# EAGLE design hashing.board (EAGLE 6.5.0)

## Sheet 1 of 4
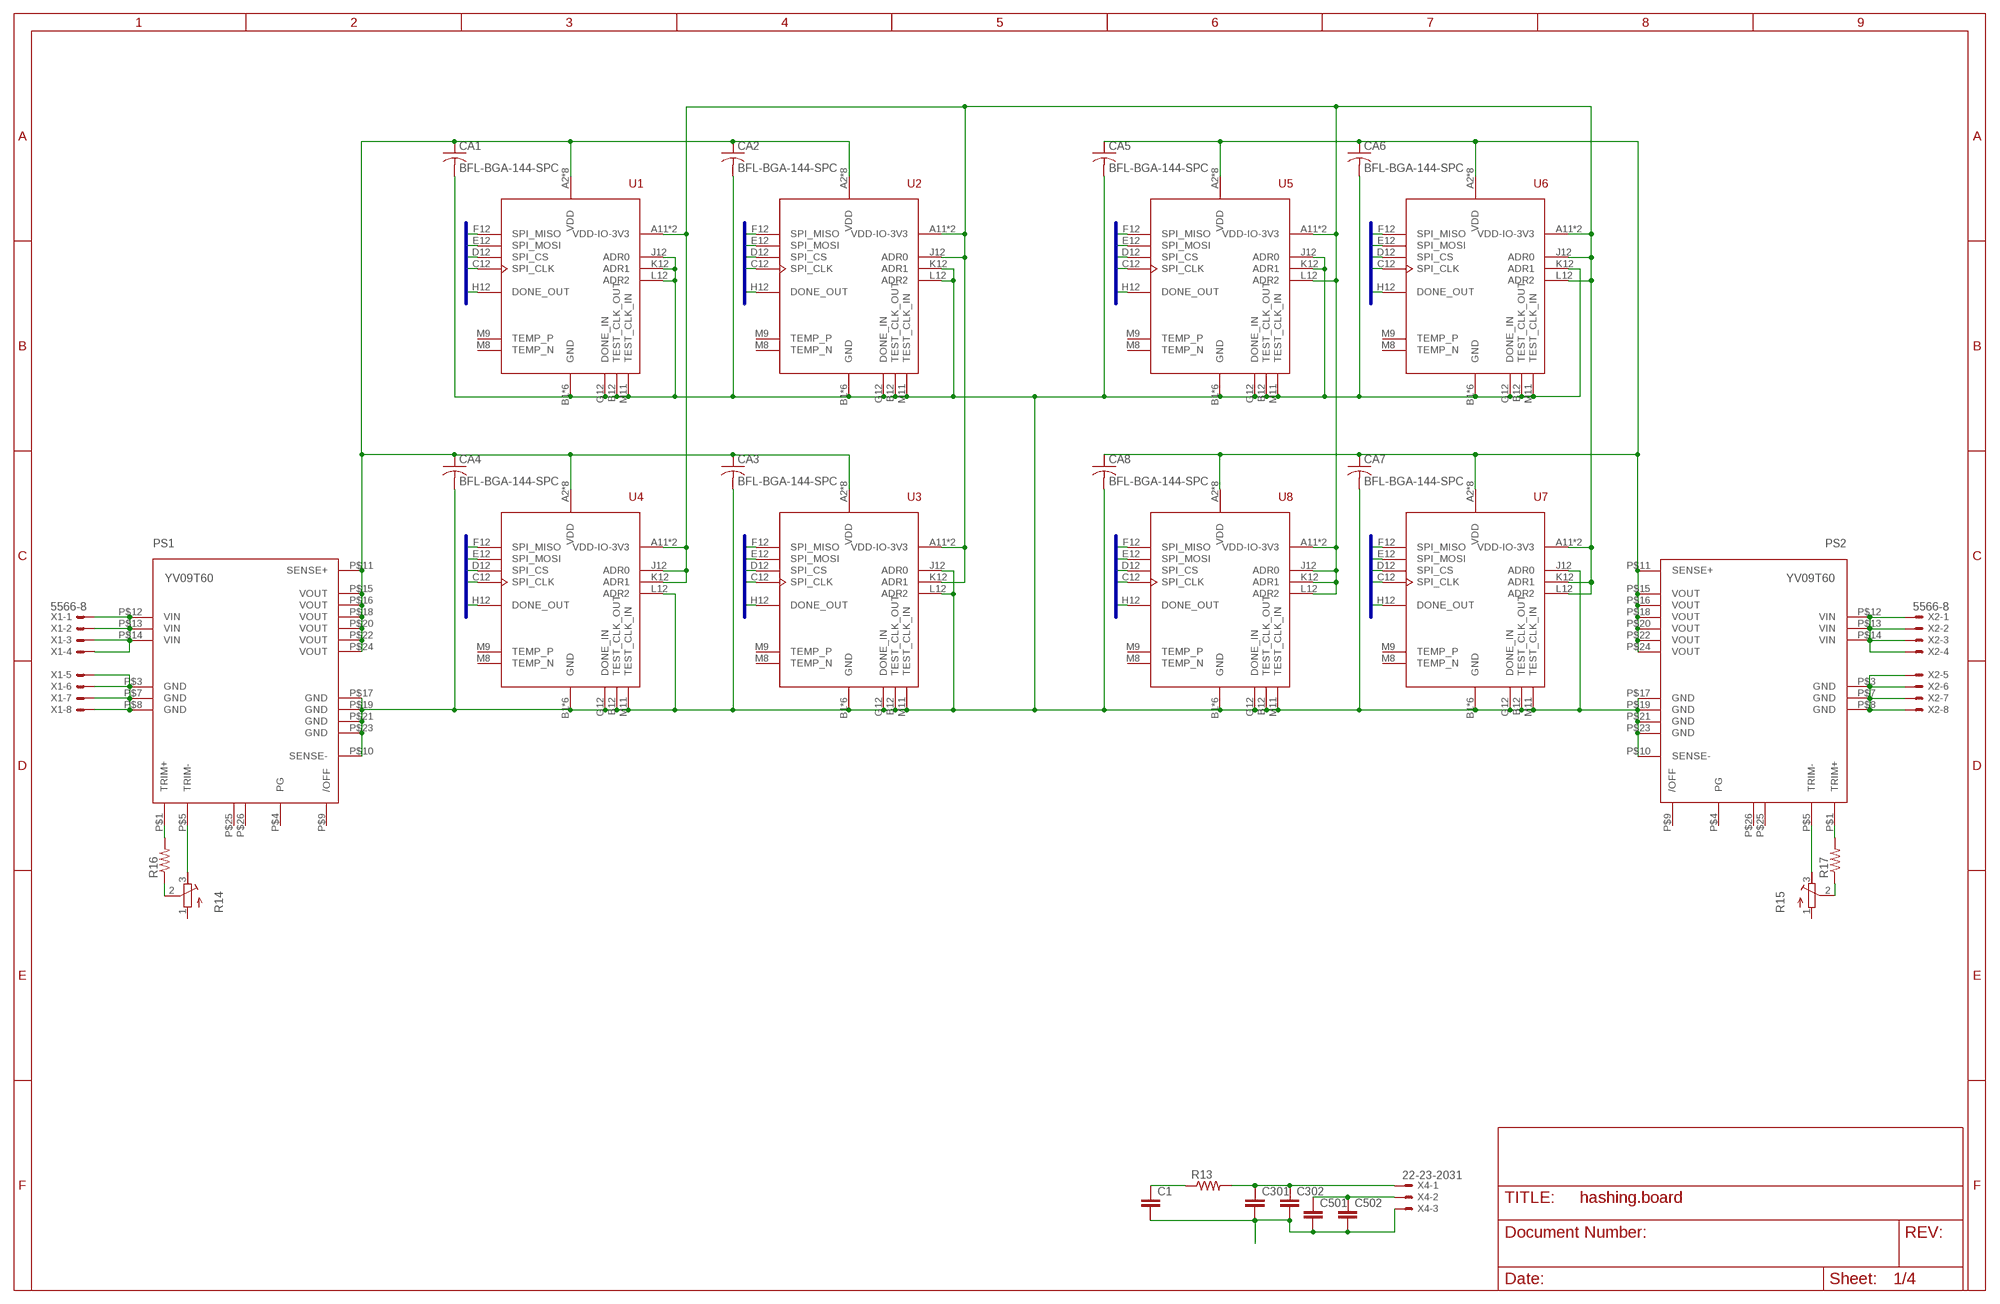
[diagram p0: schematic, sheet 1]

### Parts
C1  C-EUC0805K  [C0805K]
C301  C-EUC0805K  [C0805K]
C302  C-EUC1210K  [C1210K]
C501  C-EUC0805K  [C0805K]
C502  C-EUC1210K  [C1210K]
CA1  BFL-BGA-144-SPC  [BFL-BGA-VIA-PATTERN]
CA2  BFL-BGA-144-SPC  [BFL-BGA-VIA-PATTERN]
CA3  BFL-BGA-144-SPC  [BFL-BGA-VIA-PATTERN]
CA4  BFL-BGA-144-SPC  [BFL-BGA-VIA-PATTERN]
CA5  BFL-BGA-144-SPC  [BFL-BGA-VIA-PATTERN]
CA6  BFL-BGA-144-SPC  [BFL-BGA-VIA-PATTERN]
CA7  BFL-BGA-144-SPC  [BFL-BGA-VIA-PATTERN]
CA8  BFL-BGA-144-SPC  [BFL-BGA-VIA-PATTERN]
PS1  YV09T60  [YV09T60]
PS2  YV09T60  [YV09T60]
R13  R-US_R0805W  [R0805W]
R14  R-TRIMM3224J  [RTRIM3224J]
R15  R-TRIMM3224J  [RTRIM3224J]
R16  R-US_R0805W  [R0805W]
R17  R-US_R0805W  [R0805W]
U1  BFL-ASIC-1  [BFL-BGA-BIG-PADS]
U2  BFL-ASIC-1  [BFL-BGA-BIG-PADS]
U3  BFL-ASIC-1  [BFL-BGA-BIG-PADS]
U4  BFL-ASIC-1  [BFL-BGA-BIG-PADS]
U5  BFL-ASIC-1  [BFL-BGA-BIG-PADS]
U6  BFL-ASIC-1  [BFL-BGA-BIG-PADS]
U7  BFL-ASIC-1  [BFL-BGA-BIG-PADS]
U8  BFL-ASIC-1  [BFL-BGA-BIG-PADS]
X1  5566-8  [5566-8]
X2  5566-8  [5566-8]
X4  22-23-2031  [22-23-2031]

### Nets
DONE0: U1.H12(DONE_OUT) ; also sheet 2
DONE1: U2.H12(DONE_OUT) ; also sheet 2
DONE2: U3.H12(DONE_OUT) ; also sheet 2
DONE3: U4.H12(DONE_OUT) ; also sheet 2
DONE4: U5.H12(DONE_OUT) ; also sheet 2
DONE5: U6.H12(DONE_OUT) ; also sheet 2
DONE6: U8.H12(DONE_OUT) ; also sheet 2
DONE7: U7.H12(DONE_OUT) ; also sheet 2
GND: C1.2 C301.2 C302.2 C501.2 C502.2 CA1.N$2 CA1.N$3 CA1.N$5 CA1.N$6 CA1.N$8 CA1.N$9 CA1.N$11 CA1.N$12 CA1.N$14 CA1.N$15 CA1.N$16 CA1.N$17 CA1.N$19 CA1.N$21 CA1.N$23 CA1.N$25 CA1.N$27 CA1.N$28 CA1.N$30 CA1.N$31 CA1.N$33 CA1.N$34 CA1.N$36 CA1.N$37 CA1.N$39 CA1.N$40 CA1.N$42 CA1.N$43 CA1.N$44 CA1.N$45 CA1.N$55 CA1.N$62 CA1.N$64 CA1.N$66 CA1.N$68 CA1.N$70 CA1.N$72 CA1.N$74 CA1.N$76 CA1.N$78 CA1.N$80 CA1.N$82 CA1.N$84 CA1.N$86 CA1.N$88 CA1.N$90 CA1.N$92 CA1.N$94 CA1.N$98 CA1.N$100 CA1.N$102 CA1.N$104 CA1.N$106 CA1.N$110 CA2.N$2 CA2.N$3 CA2.N$5 CA2.N$6 CA2.N$8 CA2.N$9 CA2.N$11 CA2.N$12 CA2.N$14 CA2.N$15 CA2.N$16 CA2.N$17 CA2.N$19 CA2.N$21 CA2.N$23 CA2.N$25 CA2.N$27 CA2.N$28 CA2.N$30 CA2.N$31 CA2.N$33 CA2.N$34 CA2.N$36 CA2.N$37 CA2.N$39 CA2.N$40 CA2.N$42 CA2.N$43 CA2.N$44 CA2.N$45 CA2.N$55 CA2.N$62 CA2.N$64 CA2.N$66 CA2.N$68 CA2.N$70 CA2.N$72 CA2.N$74 CA2.N$76 CA2.N$78 CA2.N$80 CA2.N$82 CA2.N$84 CA2.N$86 CA2.N$88 CA2.N$90 CA2.N$92 CA2.N$94 CA2.N$98 CA2.N$100 CA2.N$102 CA2.N$104 CA2.N$106 CA2.N$110 CA3.N$2 CA3.N$3 CA3.N$5 CA3.N$6 CA3.N$8 CA3.N$9 CA3.N$11 CA3.N$12 CA3.N$14 CA3.N$15 CA3.N$16 CA3.N$17 CA3.N$19 CA3.N$21 CA3.N$23 CA3.N$25 CA3.N$27 CA3.N$28 CA3.N$30 CA3.N$31 CA3.N$33 CA3.N$34 CA3.N$36 CA3.N$37 CA3.N$39 CA3.N$40 CA3.N$42 CA3.N$43 CA3.N$44 CA3.N$45 CA3.N$55 CA3.N$62 CA3.N$64 CA3.N$66 CA3.N$68 CA3.N$70 CA3.N$72 CA3.N$74 CA3.N$76 CA3.N$78 CA3.N$80 CA3.N$82 CA3.N$84 CA3.N$86 CA3.N$88 CA3.N$90 CA3.N$92 CA3.N$94 CA3.N$98 CA3.N$100 CA3.N$102 CA3.N$104 CA3.N$106 CA3.N$110 CA4.N$2 CA4.N$3 CA4.N$5 CA4.N$6 CA4.N$8 CA4.N$9 CA4.N$11 CA4.N$12 CA4.N$14 CA4.N$15 CA4.N$16 CA4.N$17 CA4.N$19 CA4.N$21 CA4.N$23 CA4.N$25 CA4.N$27 CA4.N$28 CA4.N$30 CA4.N$31 CA4.N$33 CA4.N$34 CA4.N$36 CA4.N$37 CA4.N$39 CA4.N$40 CA4.N$42 CA4.N$43 CA4.N$44 CA4.N$45 CA4.N$55 CA4.N$62 CA4.N$64 CA4.N$66 CA4.N$68 CA4.N$70 CA4.N$72 CA4.N$74 CA4.N$76 CA4.N$78 CA4.N$80 CA4.N$82 CA4.N$84 CA4.N$86 CA4.N$88 CA4.N$90 CA4.N$92 CA4.N$94 CA4.N$98 CA4.N$100 CA4.N$102 CA4.N$104 CA4.N$106 CA4.N$110 CA5.N$2 CA5.N$3 CA5.N$5 CA5.N$6 CA5.N$8 CA5.N$9 CA5.N$11 CA5.N$12 CA5.N$14 CA5.N$15 CA5.N$16 CA5.N$17 CA5.N$19 CA5.N$21 CA5.N$23 CA5.N$25 CA5.N$27 CA5.N$28 CA5.N$30 CA5.N$31 CA5.N$33 CA5.N$34 CA5.N$36 CA5.N$37 CA5.N$39 CA5.N$40 CA5.N$42 CA5.N$43 CA5.N$44 CA5.N$45 CA5.N$55 CA5.N$62 CA5.N$64 CA5.N$66 CA5.N$68 CA5.N$70 CA5.N$72 CA5.N$74 CA5.N$76 CA5.N$78 CA5.N$80 CA5.N$82 CA5.N$84 CA5.N$86 CA5.N$88 CA5.N$90 CA5.N$92 CA5.N$94 CA5.N$98 CA5.N$100 CA5.N$102 CA5.N$104 CA5.N$106 CA5.N$110 CA6.N$2 CA6.N$3 CA6.N$5 CA6.N$6 CA6.N$8 CA6.N$9 CA6.N$11 CA6.N$12 CA6.N$14 CA6.N$15 CA6.N$16 CA6.N$17 CA6.N$19 CA6.N$21 CA6.N$23 CA6.N$25 CA6.N$27 CA6.N$28 CA6.N$30 CA6.N$31 CA6.N$33 CA6.N$34 CA6.N$36 CA6.N$37 CA6.N$39 CA6.N$40 CA6.N$42 CA6.N$43 CA6.N$44 CA6.N$45 CA6.N$55 CA6.N$62 CA6.N$64 CA6.N$66 CA6.N$68 CA6.N$70 CA6.N$72 CA6.N$74 CA6.N$76 CA6.N$78 CA6.N$80 CA6.N$82 CA6.N$84 CA6.N$86 CA6.N$88 CA6.N$90 CA6.N$92 CA6.N$94 CA6.N$98 CA6.N$100 CA6.N$102 CA6.N$104 CA6.N$106 CA6.N$110 CA7.N$2 CA7.N$3 CA7.N$5 CA7.N$6 CA7.N$8 CA7.N$9 CA7.N$11 CA7.N$12 CA7.N$14 CA7.N$15 CA7.N$16 CA7.N$17 CA7.N$19 CA7.N$21 CA7.N$23 CA7.N$25 CA7.N$27 CA7.N$28 CA7.N$30 CA7.N$31 CA7.N$33 CA7.N$34 CA7.N$36 CA7.N$37 CA7.N$39 CA7.N$40 CA7.N$42 CA7.N$43 CA7.N$44 CA7.N$45 CA7.N$55 CA7.N$62 CA7.N$64 CA7.N$66 CA7.N$68 CA7.N$70 CA7.N$72 CA7.N$74 CA7.N$76 CA7.N$78 CA7.N$80 CA7.N$82 CA7.N$84 CA7.N$86 CA7.N$88 CA7.N$90 CA7.N$92 CA7.N$94 CA7.N$98 CA7.N$100 CA7.N$102 CA7.N$104 CA7.N$106 CA7.N$110 CA8.N$2 CA8.N$3 CA8.N$5 CA8.N$6 CA8.N$8 CA8.N$9 CA8.N$11 CA8.N$12 CA8.N$14 CA8.N$15 CA8.N$16 CA8.N$17 CA8.N$19 CA8.N$21 CA8.N$23 CA8.N$25 CA8.N$27 CA8.N$28 CA8.N$30 CA8.N$31 CA8.N$33 CA8.N$34 CA8.N$36 CA8.N$37 CA8.N$39 CA8.N$40 CA8.N$42 CA8.N$43 CA8.N$44 CA8.N$45 CA8.N$55 CA8.N$62 CA8.N$64 CA8.N$66 CA8.N$68 CA8.N$70 CA8.N$72 CA8.N$74 CA8.N$76 CA8.N$78 CA8.N$80 CA8.N$82 CA8.N$84 CA8.N$86 CA8.N$88 CA8.N$90 CA8.N$92 CA8.N$94 CA8.N$98 CA8.N$100 CA8.N$102 CA8.N$104 CA8.N$106 CA8.N$110 PS1.P$3(GND) PS1.P$7(GND) PS1.P$8(GND) PS1.P$10(SENSE-) PS1.P$17(GND) PS1.P$19(GND) PS1.P$21(GND) PS1.P$23(GND) PS2.P$3(GND) PS2.P$7(GND) PS2.P$8(GND) PS2.P$10(SENSE-) PS2.P$17(GND) PS2.P$19(GND) PS2.P$21(GND) PS2.P$23(GND) U1.B1(GND) U1.B3(GND) U1.B5(GND) U1.B7(GND) U1.B9(GND) U1.B11(GND) U1.B12(TEST_CLK_OUT) U1.G12(DONE_IN) U1.J12(ADR0) U1.K12(ADR1) U1.L12(ADR2) U1.M11(TEST_CLK_IN) U2.B1(GND) U2.B3(GND) U2.B5(GND) U2.B7(GND) U2.B9(GND) U2.B11(GND) U2.B12(TEST_CLK_OUT) U2.G12(DONE_IN) U2.K12(ADR1) U2.L12(ADR2) U2.M11(TEST_CLK_IN) U3.B1(GND) U3.B3(GND) U3.B5(GND) U3.B7(GND) U3.B9(GND) U3.B11(GND) U3.B12(TEST_CLK_OUT) U3.G12(DONE_IN) U3.J12(ADR0) U3.L12(ADR2) U3.M11(TEST_CLK_IN) U4.B1(GND) U4.B3(GND) U4.B5(GND) U4.B7(GND) U4.B9(GND) U4.B11(GND) U4.B12(TEST_CLK_OUT) U4.G12(DONE_IN) U4.L12(ADR2) U4.M11(TEST_CLK_IN) U5.B1(GND) U5.B3(GND) U5.B5(GND) U5.B7(GND) U5.B9(GND) U5.B11(GND) U5.B12(TEST_CLK_OUT) U5.G12(DONE_IN) U5.J12(ADR0) U5.K12(ADR1) U5.M11(TEST_CLK_IN) U6.B1(GND) U6.B3(GND) U6.B5(GND) U6.B7(GND) U6.B9(GND) U6.B11(GND) U6.B12(TEST_CLK_OUT) U6.G12(DONE_IN) U6.K12(ADR1) U6.M11(TEST_CLK_IN) U7.B1(GND) U7.B3(GND) U7.B5(GND) U7.B7(GND) U7.B9(GND) U7.B11(GND) U7.B12(TEST_CLK_OUT) U7.G12(DONE_IN) U7.J12(ADR0) U7.M11(TEST_CLK_IN) U8.B1(GND) U8.B3(GND) U8.B5(GND) U8.B7(GND) U8.B9(GND) U8.B11(GND) U8.B12(TEST_CLK_OUT) U8.G12(DONE_IN) U8.M11(TEST_CLK_IN) X1.5 X1.6 X1.7 X1.8 X2.5 X2.6 X2.7 X2.8 X4.3 ; also sheet 2
N$5: R15.2(S) R17.1
N$6: PS2.P$1(TRIM+) R17.2
N$7: PS2.P$5(TRIM-) R15.3(A)
N$8: PS1.P$5(TRIM-) R14.3(A)
N$9: R14.2(S) R16.1
N$10: PS1.P$1(TRIM+) R16.2
SPI_1_CLK: U1.C12(SPI_CLK) U2.C12(SPI_CLK) U3.C12(SPI_CLK) U4.C12(SPI_CLK) U5.C12(SPI_CLK) U6.C12(SPI_CLK) U7.C12(SPI_CLK) U8.C12(SPI_CLK) ; also sheet 2
SPI_1_CS: U1.D12(SPI_CS) U2.D12(SPI_CS) U3.D12(SPI_CS) U4.D12(SPI_CS) U5.D12(SPI_CS) U6.D12(SPI_CS) U7.D12(SPI_CS) U8.D12(SPI_CS) ; also sheet 2
SPI_1_MISO: U1.F12(SPI_MISO) U2.F12(SPI_MISO) U3.F12(SPI_MISO) U4.F12(SPI_MISO) U5.F12(SPI_MISO) U6.F12(SPI_MISO) U7.F12(SPI_MISO) U8.F12(SPI_MISO) ; also sheet 2
SPI_1_MOSI: U1.E12(SPI_MOSI) U2.E12(SPI_MOSI) U3.E12(SPI_MOSI) U4.E12(SPI_MOSI) U5.E12(SPI_MOSI) U6.E12(SPI_MOSI) U7.E12(SPI_MOSI) U8.E12(SPI_MOSI) ; also sheet 2
VDD-1A: CA1.P$1 CA1.P$4 CA1.P$7 CA1.P$10 CA1.P$13 CA1.P$18 CA1.P$20 CA1.P$22 CA1.P$24 CA1.P$26 CA1.P$29 CA1.P$32 CA1.P$35 CA1.P$38 CA1.P$41 CA1.P$46 CA1.P$47 CA1.P$48 CA1.P$50 CA1.P$51 CA1.P$52 CA1.P$53 CA1.P$54 CA1.P$56 CA1.P$57 CA1.P$58 CA1.P$59 CA1.P$60 CA1.P$61 CA1.P$63 CA1.P$65 CA1.P$67 CA1.P$69 CA1.P$71 CA1.P$73 CA1.P$75 CA1.P$77 CA1.P$79 CA1.P$81 CA1.P$83 CA1.P$85 CA1.P$87 CA1.P$89 CA1.P$91 CA1.P$93 CA1.P$95 CA1.P$99 CA1.P$101 CA1.P$103 CA1.P$105 CA1.P$107 CA1.P$111 CA2.P$1 CA2.P$4 CA2.P$7 CA2.P$10 CA2.P$13 CA2.P$18 CA2.P$20 CA2.P$22 CA2.P$24 CA2.P$26 CA2.P$29 CA2.P$32 CA2.P$35 CA2.P$38 CA2.P$41 CA2.P$46 CA2.P$47 CA2.P$48 CA2.P$50 CA2.P$51 CA2.P$52 CA2.P$53 CA2.P$54 CA2.P$56 CA2.P$57 CA2.P$58 CA2.P$59 CA2.P$60 CA2.P$61 CA2.P$63 CA2.P$65 CA2.P$67 CA2.P$69 CA2.P$71 CA2.P$73 CA2.P$75 CA2.P$77 CA2.P$79 CA2.P$81 CA2.P$83 CA2.P$85 CA2.P$87 CA2.P$89 CA2.P$91 CA2.P$93 CA2.P$95 CA2.P$99 CA2.P$101 CA2.P$103 CA2.P$105 CA2.P$107 CA2.P$111 CA3.P$1 CA3.P$4 CA3.P$7 CA3.P$10 CA3.P$13 CA3.P$18 CA3.P$20 CA3.P$22 CA3.P$24 CA3.P$26 CA3.P$29 CA3.P$32 CA3.P$35 CA3.P$38 CA3.P$41 CA3.P$46 CA3.P$47 CA3.P$48 CA3.P$50 CA3.P$51 CA3.P$52 CA3.P$53 CA3.P$54 CA3.P$56 CA3.P$57 CA3.P$58 CA3.P$59 CA3.P$60 CA3.P$61 CA3.P$63 CA3.P$65 CA3.P$67 CA3.P$69 CA3.P$71 CA3.P$73 CA3.P$75 CA3.P$77 CA3.P$79 CA3.P$81 CA3.P$83 CA3.P$85 CA3.P$87 CA3.P$89 CA3.P$91 CA3.P$93 CA3.P$95 CA3.P$99 CA3.P$101 CA3.P$103 CA3.P$105 CA3.P$107 CA3.P$111 CA4.P$1 CA4.P$4 CA4.P$7 CA4.P$10 CA4.P$13 CA4.P$18 CA4.P$20 CA4.P$22 CA4.P$24 CA4.P$26 CA4.P$29 CA4.P$32 CA4.P$35 CA4.P$38 CA4.P$41 CA4.P$46 CA4.P$47 CA4.P$48 CA4.P$50 CA4.P$51 CA4.P$52 CA4.P$53 CA4.P$54 CA4.P$56 CA4.P$57 CA4.P$58 CA4.P$59 CA4.P$60 CA4.P$61 CA4.P$63 CA4.P$65 CA4.P$67 CA4.P$69 CA4.P$71 CA4.P$73 CA4.P$75 CA4.P$77 CA4.P$79 CA4.P$81 CA4.P$83 CA4.P$85 CA4.P$87 CA4.P$89 CA4.P$91 CA4.P$93 CA4.P$95 CA4.P$99 CA4.P$101 CA4.P$103 CA4.P$105 CA4.P$107 CA4.P$111 PS1.P$11(SENSE+) PS1.P$15(VOUT) PS1.P$16(VOUT) PS1.P$18(VOUT) PS1.P$20(VOUT) PS1.P$22(VOUT) PS1.P$24(VOUT) U1.A2(VDD) U1.A4(VDD) U1.A6(VDD) U1.A8(VDD) U1.A9(VDD) U1.A10(VDD) U1.M5(VDD) U1.M7(VDD) U2.A2(VDD) U2.A4(VDD) U2.A6(VDD) U2.A8(VDD) U2.A9(VDD) U2.A10(VDD) U2.M5(VDD) U2.M7(VDD) U3.A2(VDD) U3.A4(VDD) U3.A6(VDD) U3.A8(VDD) U3.A9(VDD) U3.A10(VDD) U3.M5(VDD) U3.M7(VDD) U4.A2(VDD) U4.A4(VDD) U4.A6(VDD) U4.A8(VDD) U4.A9(VDD) U4.A10(VDD) U4.M5(VDD) U4.M7(VDD)
VDD-1B: CA5.P$1 CA5.P$4 CA5.P$7 CA5.P$10 CA5.P$13 CA5.P$18 CA5.P$20 CA5.P$22 CA5.P$24 CA5.P$26 CA5.P$29 CA5.P$32 CA5.P$35 CA5.P$38 CA5.P$41 CA5.P$46 CA5.P$47 CA5.P$48 CA5.P$50 CA5.P$51 CA5.P$52 CA5.P$53 CA5.P$54 CA5.P$56 CA5.P$57 CA5.P$58 CA5.P$59 CA5.P$60 CA5.P$61 CA5.P$63 CA5.P$65 CA5.P$67 CA5.P$69 CA5.P$71 CA5.P$73 CA5.P$75 CA5.P$77 CA5.P$79 CA5.P$81 CA5.P$83 CA5.P$85 CA5.P$87 CA5.P$89 CA5.P$91 CA5.P$93 CA5.P$95 CA5.P$99 CA5.P$101 CA5.P$103 CA5.P$105 CA5.P$107 CA5.P$111 CA6.P$1 CA6.P$4 CA6.P$7 CA6.P$10 CA6.P$13 CA6.P$18 CA6.P$20 CA6.P$22 CA6.P$24 CA6.P$26 CA6.P$29 CA6.P$32 CA6.P$35 CA6.P$38 CA6.P$41 CA6.P$46 CA6.P$47 CA6.P$48 CA6.P$50 CA6.P$51 CA6.P$52 CA6.P$53 CA6.P$54 CA6.P$56 CA6.P$57 CA6.P$58 CA6.P$59 CA6.P$60 CA6.P$61 CA6.P$63 CA6.P$65 CA6.P$67 CA6.P$69 CA6.P$71 CA6.P$73 CA6.P$75 CA6.P$77 CA6.P$79 CA6.P$81 CA6.P$83 CA6.P$85 CA6.P$87 CA6.P$89 CA6.P$91 CA6.P$93 CA6.P$95 CA6.P$99 CA6.P$101 CA6.P$103 CA6.P$105 CA6.P$107 CA6.P$111 CA7.P$1 CA7.P$4 CA7.P$7 CA7.P$10 CA7.P$13 CA7.P$18 CA7.P$20 CA7.P$22 CA7.P$24 CA7.P$26 CA7.P$29 CA7.P$32 CA7.P$35 CA7.P$38 CA7.P$41 CA7.P$46 CA7.P$47 CA7.P$48 CA7.P$50 CA7.P$51 CA7.P$52 CA7.P$53 CA7.P$54 CA7.P$56 CA7.P$57 CA7.P$58 CA7.P$59 CA7.P$60 CA7.P$61 CA7.P$63 CA7.P$65 CA7.P$67 CA7.P$69 CA7.P$71 CA7.P$73 CA7.P$75 CA7.P$77 CA7.P$79 CA7.P$81 CA7.P$83 CA7.P$85 CA7.P$87 CA7.P$89 CA7.P$91 CA7.P$93 CA7.P$95 CA7.P$99 CA7.P$101 CA7.P$103 CA7.P$105 CA7.P$107 CA7.P$111 CA8.P$1 CA8.P$4 CA8.P$7 CA8.P$10 CA8.P$13 CA8.P$18 CA8.P$20 CA8.P$22 CA8.P$24 CA8.P$26 CA8.P$29 CA8.P$32 CA8.P$35 CA8.P$38 CA8.P$41 CA8.P$46 CA8.P$47 CA8.P$48 CA8.P$50 CA8.P$51 CA8.P$52 CA8.P$53 CA8.P$54 CA8.P$56 CA8.P$57 CA8.P$58 CA8.P$59 CA8.P$60 CA8.P$61 CA8.P$63 CA8.P$65 CA8.P$67 CA8.P$69 CA8.P$71 CA8.P$73 CA8.P$75 CA8.P$77 CA8.P$79 CA8.P$81 CA8.P$83 CA8.P$85 CA8.P$87 CA8.P$89 CA8.P$91 CA8.P$93 CA8.P$95 CA8.P$99 CA8.P$101 CA8.P$103 CA8.P$105 CA8.P$107 CA8.P$111 PS2.P$11(SENSE+) PS2.P$15(VOUT) PS2.P$16(VOUT) PS2.P$18(VOUT) PS2.P$20(VOUT) PS2.P$22(VOUT) PS2.P$24(VOUT) U5.A2(VDD) U5.A4(VDD) U5.A6(VDD) U5.A8(VDD) U5.A9(VDD) U5.A10(VDD) U5.M5(VDD) U5.M7(VDD) U6.A2(VDD) U6.A4(VDD) U6.A6(VDD) U6.A8(VDD) U6.A9(VDD) U6.A10(VDD) U6.M5(VDD) U6.M7(VDD) U7.A2(VDD) U7.A4(VDD) U7.A6(VDD) U7.A8(VDD) U7.A9(VDD) U7.A10(VDD) U7.M5(VDD) U7.M7(VDD) U8.A2(VDD) U8.A4(VDD) U8.A6(VDD) U8.A8(VDD) U8.A9(VDD) U8.A10(VDD) U8.M5(VDD) U8.M7(VDD)
VDD-3V3: C1.1 R13.1 U1.A11(VDD-IO-3V3) U1.M10(VDD-IO-3V3) U2.A11(VDD-IO-3V3) U2.J12(ADR0) U2.M10(VDD-IO-3V3) U3.A11(VDD-IO-3V3) U3.K12(ADR1) U3.M10(VDD-IO-3V3) U4.A11(VDD-IO-3V3) U4.J12(ADR0) U4.K12(ADR1) U4.M10(VDD-IO-3V3) U5.A11(VDD-IO-3V3) U5.L12(ADR2) U5.M10(VDD-IO-3V3) U6.A11(VDD-IO-3V3) U6.J12(ADR0) U6.L12(ADR2) U6.M10(VDD-IO-3V3) U7.A11(VDD-IO-3V3) U7.K12(ADR1) U7.L12(ADR2) U7.M10(VDD-IO-3V3) U8.A11(VDD-IO-3V3) U8.J12(ADR0) U8.K12(ADR1) U8.L12(ADR2) U8.M10(VDD-IO-3V3)
VIN1: PS1.P$12(VIN) PS1.P$13(VIN) PS1.P$14(VIN) X1.1 X1.2 X1.3 X1.4
VIN2: PS2.P$12(VIN) PS2.P$13(VIN) PS2.P$14(VIN) X2.1 X2.2 X2.3 X2.4
VIN-3.3V: C301.1 C302.1 R13.2 X4.1
VIN-5.0V: C501.1 C502.1 X4.2
Unconnected: PS1.P$2 PS1.P$4(PG) PS1.P$6(DNC) PS1.P$9(/OFF) PS1.P$25(MECH1) PS1.P$26(MECH2) PS2.P$2 PS2.P$4(PG) PS2.P$6(DNC) PS2.P$9(/OFF) PS2.P$25(MECH1) PS2.P$26(MECH2) R14.1(E) R15.1(E) U1.M8(TEMP_N) U1.M9(TEMP_P) U2.M8(TEMP_N) U2.M9(TEMP_P) U3.M8(TEMP_N) U3.M9(TEMP_P) U4.M8(TEMP_N) U4.M9(TEMP_P) U5.M8(TEMP_N) U5.M9(TEMP_P) U6.M8(TEMP_N) U6.M9(TEMP_P) U7.M8(TEMP_N) U7.M9(TEMP_P) U8.M8(TEMP_N) U8.M9(TEMP_P)

### Buses
ASIC_COM:SPI_1_MISO,SPI_1_MOSI,SPI_1_CLK,SPI_1_CS,DONE[0..7]

## Sheet 2 of 4
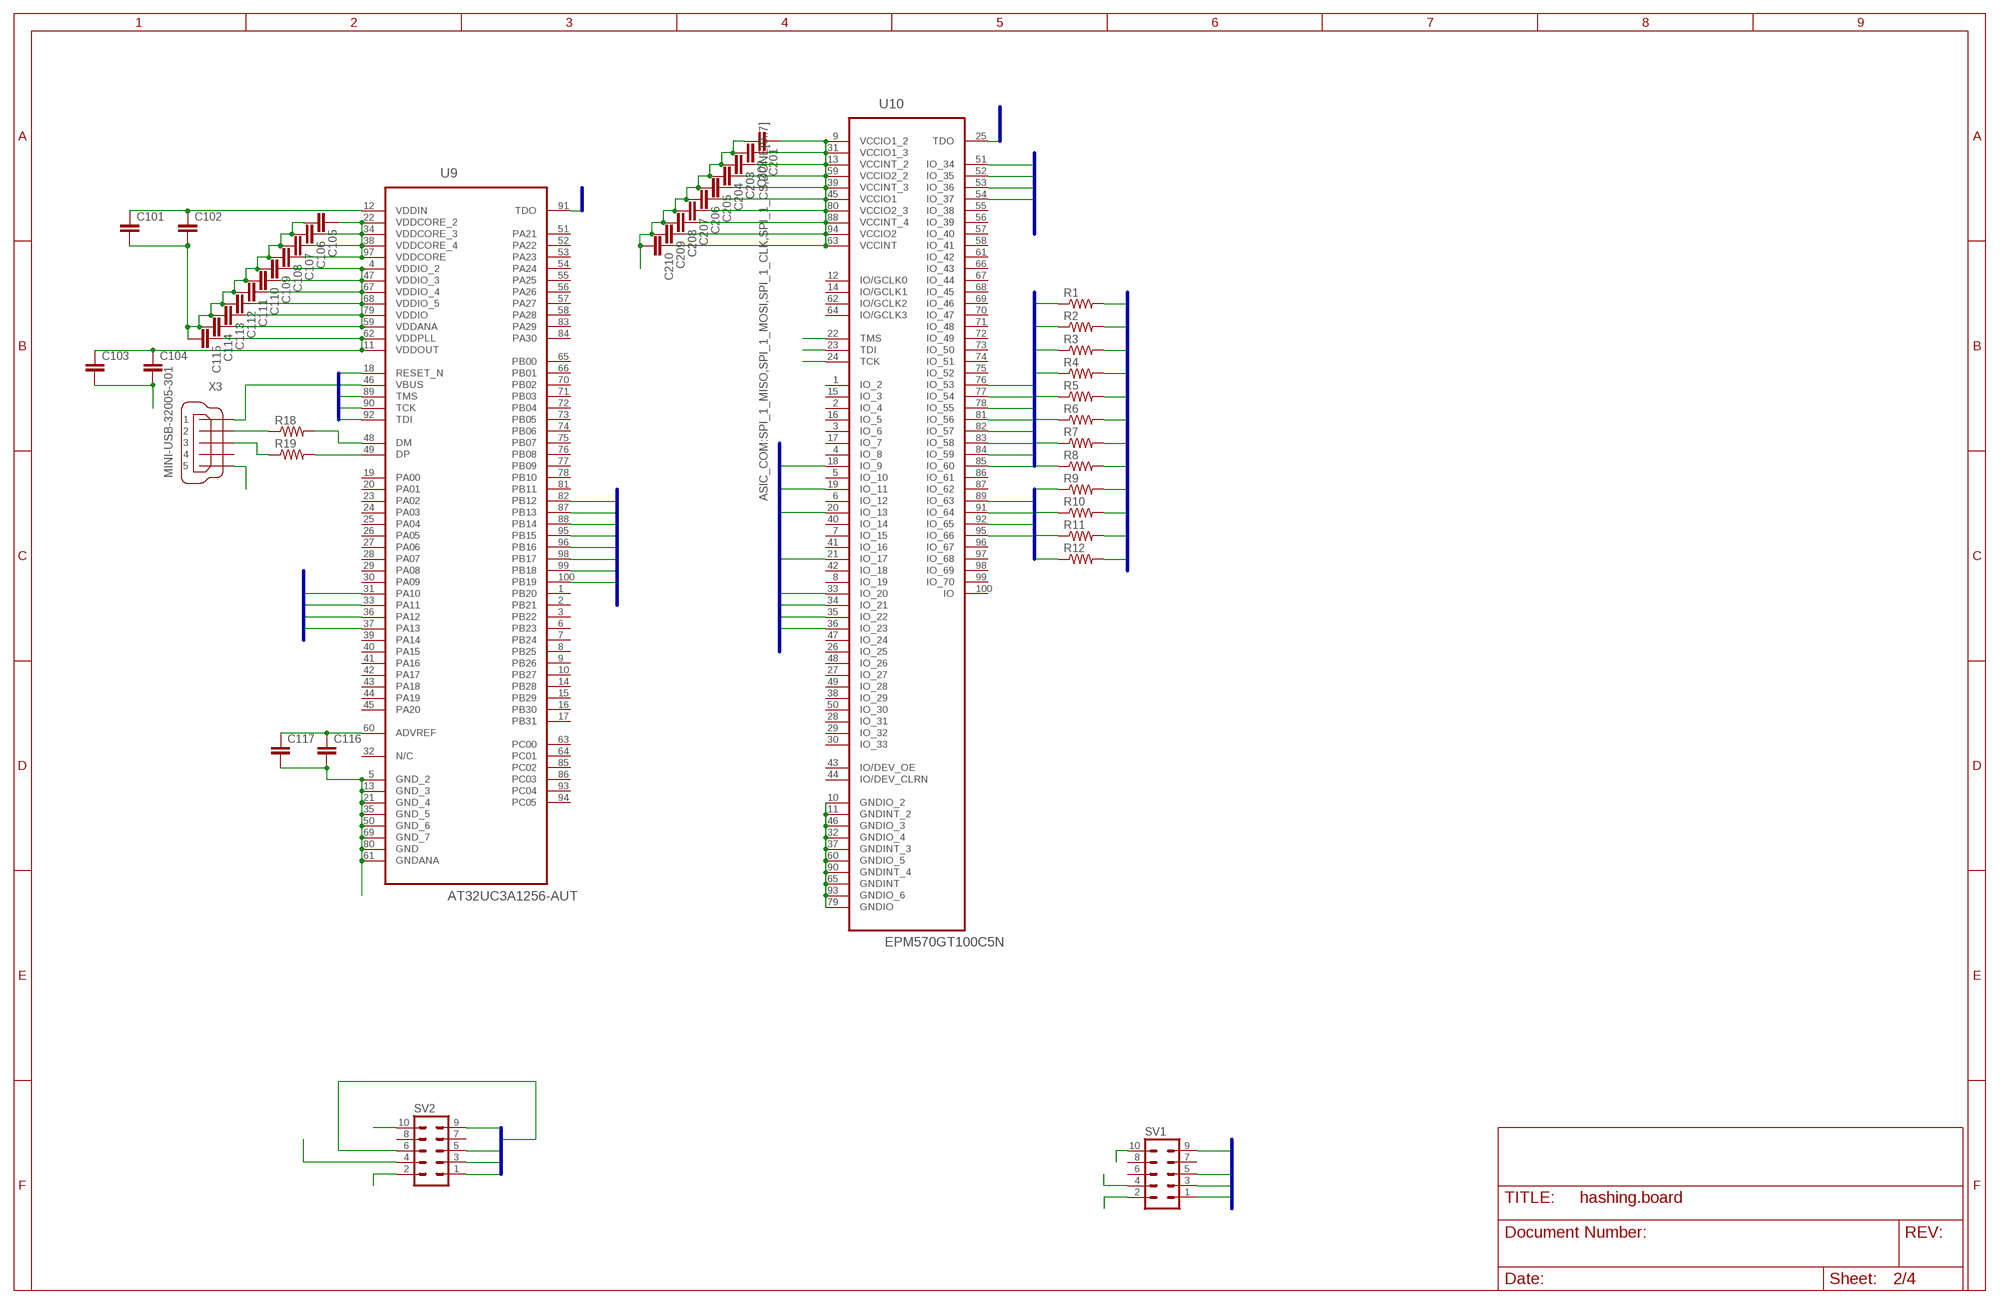
[diagram p1: schematic, sheet 2]

### Parts
C101  C-EUC0402  [C0402]
C102  C-EUC0402  [C0402]
C103  C-EUC0402  [C0402]
C104  C-EUC0402  [C0402]
C105  C-EUC0402  [C0402]
C106  C-EUC0402  [C0402]
C107  C-EUC0402  [C0402]
C108  C-EUC0402  [C0402]
C109  C-EUC0402  [C0402]
C110  C-EUC0402  [C0402]
C111  C-EUC0402  [C0402]
C112  C-EUC0402  [C0402]
C113  C-EUC0402  [C0402]
C114  C-EUC0402  [C0402]
C115  C-EUC0402  [C0402]
C116  C-EUC0402  [C0402]
C117  C-EUC0402  [C0402]
C201  C-EUC0402  [C0402]
C202  C-EUC0402  [C0402]
C203  C-EUC0402  [C0402]
C204  C-EUC0402  [C0402]
C205  C-EUC0402  [C0402]
C206  C-EUC0402  [C0402]
C207  C-EUC0402  [C0402]
C208  C-EUC0402  [C0402]
C209  C-EUC0402  [C0402]
C210  C-EUC0402  [C0402]
R1  R-US_R0201  [R0201]
R2  R-US_R0201  [R0201]
R3  R-US_R0201  [R0201]
R4  R-US_R0201  [R0201]
R5  R-US_R0201  [R0201]
R6  R-US_R0201  [R0201]
R7  R-US_R0201  [R0201]
R8  R-US_R0201  [R0201]
R9  R-US_R0201  [R0201]
R10  R-US_R0201  [R0201]
R11  R-US_R0201  [R0201]
R12  R-US_R0201  [R0201]
R18  R-US_R0603  [R0603]
R19  R-US_R0603  [R0603]
SV1  MA05-2  [MA05-2]
SV2  MA05-2  [MA05-2]
U9  AT32UC3A1256-AUT  [QFP50P1600X1600X120-100N]
U10  EPM570GT100C5N  [QFP50P1600X1600X120-100N]
X3  MINI-USB-32005-301  [32005-301]

### Nets
ATMEL_RST: SV2.6 U9.18(RESET_N)
ATMEL_TCK: SV2.1 U9.90(TCK)
ATMEL_TDI: SV2.9 U9.92(TDI)
ATMEL_TDO: SV2.3 U9.91(TDO)
ATMEL_TMS: SV2.5 U9.89(TMS)
CHECK_VOLTAGE: U9.46(VBUS) X3.1
CPLD_TCK: SV1.1 U10.24(TCK)
CPLD_TDI: SV1.9 U10.23(TDI)
CPLD_TDO: SV1.3 U10.25(TDO)
CPLD_TMS: SV1.5 U10.22(TMS)
DONE0: R1.2 U10.18(IO_9) ; also sheet 1
DONE1: R2.2 U10.19(IO_11) ; also sheet 1
DONE2: R3.2 U10.20(IO_13) ; also sheet 1
DONE3: R4.2 U10.21(IO_17) ; also sheet 1
DONE4: R5.2 U10.51(IO_34) ; also sheet 1
DONE5: R6.2 U10.52(IO_35) ; also sheet 1
DONE6: R7.2 U10.53(IO_36) ; also sheet 1
DONE7: R8.2 U10.54(IO_37) ; also sheet 1
DONE_0: R1.1 U9.82(PB12) U10.76(IO_53)
DONE_1: R2.1 U9.87(PB13) U10.77(IO_54)
DONE_2: R3.1 U9.88(PB14) U10.78(IO_55)
DONE_3: R4.1 U9.95(PB15) U10.81(IO_56)
DONE_4: R5.1 U9.96(PB16) U10.82(IO_57)
DONE_5: R6.1 U9.98(PB17) U10.83(IO_58)
DONE_6: R7.1 U9.99(PB18) U10.84(IO_59)
DONE_7: R8.1 U9.100(PB19) U10.85(IO_60)
GND: C101.2 C102.2 C103.2 C104.2 C105.2 C106.2 C107.2 C108.2 C109.2 C110.2 C111.2 C112.2 C113.2 C114.2 C115.2 C116.2 C117.2 C201.2 C202.2 C203.2 C204.2 C205.2 C206.2 C207.2 C208.2 C209.2 C210.2 SV1.2 SV1.10 SV2.2 SV2.10 U9.5(GND_2) U9.13(GND_3) U9.21(GND_4) U9.35(GND_5) U9.50(GND_6) U9.61(GNDANA) U9.69(GND_7) U9.80(GND) U10.10(GNDIO_2) U10.11(GNDINT_2) U10.32(GNDIO_4) U10.37(GNDINT_3) U10.46(GNDIO_3) U10.60(GNDIO_5) U10.65(GNDINT) U10.79(GNDIO) U10.90(GNDINT_4) U10.93(GNDIO_6) X3.5 ; also sheet 1
N$11: R18.1 X3.2
N$12: R19.1 X3.3
N$13: R19.2 U9.49(DP)
N$14: R18.2 U9.48(DM)
SPI_1_CLK: R11.2 U10.35(IO_22) ; also sheet 1
SPI_1_CLK_: R11.1 U9.37(PA13) U10.89(IO_63)
SPI_1_CS: R12.2 U10.36(IO_23) ; also sheet 1
SPI_1_CS_: R12.1 U9.31(PA10) U10.95(IO_66)
SPI_1_MISO: R9.2 U10.33(IO_20) ; also sheet 1
SPI_1_MISO_: R9.1 U9.33(PA11) U10.92(IO_65)
SPI_1_MOSI: R10.2 U10.34(IO_21) ; also sheet 1
SPI_1_MOSI_: R10.1 U9.36(PA12) U10.91(IO_64)
VCC+1V8: C103.1 C104.1 C105.1 C106.1 C107.1 C108.1 C115.1 U9.11(VDDOUT) U9.22(VDDCORE_2) U9.34(VDDCORE_3) U9.38(VDDCORE_4) U9.62(VDDPLL) U9.97(VDDCORE)
VCC+3V3: C101.1 C102.1 C109.1 C110.1 C111.1 C112.1 C113.1 C114.1 C116.1 C117.1 C201.1 C202.1 C203.1 C204.1 C205.1 C206.1 C207.1 C208.1 C209.1 C210.1 SV1.4 SV2.4 U9.4(VDDIO_2) U9.12(VDDIN) U9.47(VDDIO_3) U9.59(VDDANA) U9.60(ADVREF) U9.67(VDDIO_4) U9.68(VDDIO_5) U9.79(VDDIO) U10.9(VCCIO1_2) U10.13(VCCINT_2) U10.31(VCCIO1_3) U10.39(VCCINT_3) U10.45(VCCIO1) U10.59(VCCIO2_2) U10.63(VCCINT) U10.80(VCCIO2_3) U10.88(VCCINT_4) U10.94(VCCIO2)
Unconnected: SV1.6 SV1.7 SV1.8 SV2.7 SV2.8 U9.1(PB20) U9.2(PB21) U9.3(PB22) U9.6(PB23) U9.7(PB24) U9.8(PB25) U9.9(PB26) U9.10(PB27) U9.14(PB28) U9.15(PB29) U9.16(PB30) U9.17(PB31) U9.19(PA00) U9.20(PA01) U9.23(PA02) U9.24(PA03) U9.25(PA04) U9.26(PA05) U9.27(PA06) U9.28(PA07) U9.29(PA08) U9.30(PA09) U9.32(N/C) U9.39(PA14) U9.40(PA15) U9.41(PA16) U9.42(PA17) U9.43(PA18) U9.44(PA19) U9.45(PA20) U9.51(PA21) U9.52(PA22) U9.53(PA23) U9.54(PA24) U9.55(PA25) U9.56(PA26) U9.57(PA27) U9.58(PA28) U9.63(PC00) U9.64(PC01) U9.65(PB00) U9.66(PB01) U9.70(PB02) U9.71(PB03) U9.72(PB04) U9.73(PB05) U9.74(PB06) U9.75(PB07) U9.76(PB08) U9.77(PB09) U9.78(PB10) U9.81(PB11) U9.83(PA29) U9.84(PA30) U9.85(PC02) U9.86(PC03) U9.93(PC04) U9.94(PC05) U10.1(IO_2) U10.2(IO_4) U10.3(IO_6) U10.4(IO_8) U10.5(IO_10) U10.6(IO_12) U10.7(IO_15) U10.8(IO_19) U10.12(IO/GCLK0) U10.14(IO/GCLK1) U10.15(IO_3) U10.16(IO_5) U10.17(IO_7) U10.26(IO_25) U10.27(IO_27) U10.28(IO_31) U10.29(IO_32) U10.30(IO_33) U10.38(IO_29) U10.40(IO_14) U10.41(IO_16) U10.42(IO_18) U10.43(IO/DEV_OE) U10.44(IO/DEV_CLRN) U10.47(IO_24) U10.48(IO_26) U10.49(IO_28) U10.50(IO_30) U10.55(IO_38) U10.56(IO_39) U10.57(IO_40) U10.58(IO_41) U10.61(IO_42) U10.62(IO/GCLK2) U10.64(IO/GCLK3) U10.66(IO_43) U10.67(IO_44) U10.68(IO_45) U10.69(IO_46) U10.70(IO_47) U10.71(IO_48) U10.72(IO_49) U10.73(IO_50) U10.74(IO_51) U10.75(IO_52) U10.86(IO_61) U10.87(IO_62) U10.96(IO_67) U10.97(IO_68) U10.98(IO_69) U10.99(IO_70) U10.100(IO) X3.4

### Buses
ASIC_COM:SPI_1_MISO,SPI_1_MOSI,SPI_1_CLK,SPI_1_CS,DONE[0..7]
CPLD_COM:SPI_1_MISO_,SPI_1_MOSI_,SPI_1_CLK_,SPI_1_CS_,DONE_[0..7]
CPLD_OUTPUT:DONE_[0..7]
CPLD_JTAG:CPLD_TMS,CPLD_TDI,CPLD_TCK,CPLD_TDO
ATMEL_JTAG:ATMEL_TMS,ATMEL_TDI,ATMEL_TCK,ATMEL_TDO,ATMEL_RST

## Sheet 3 of 4
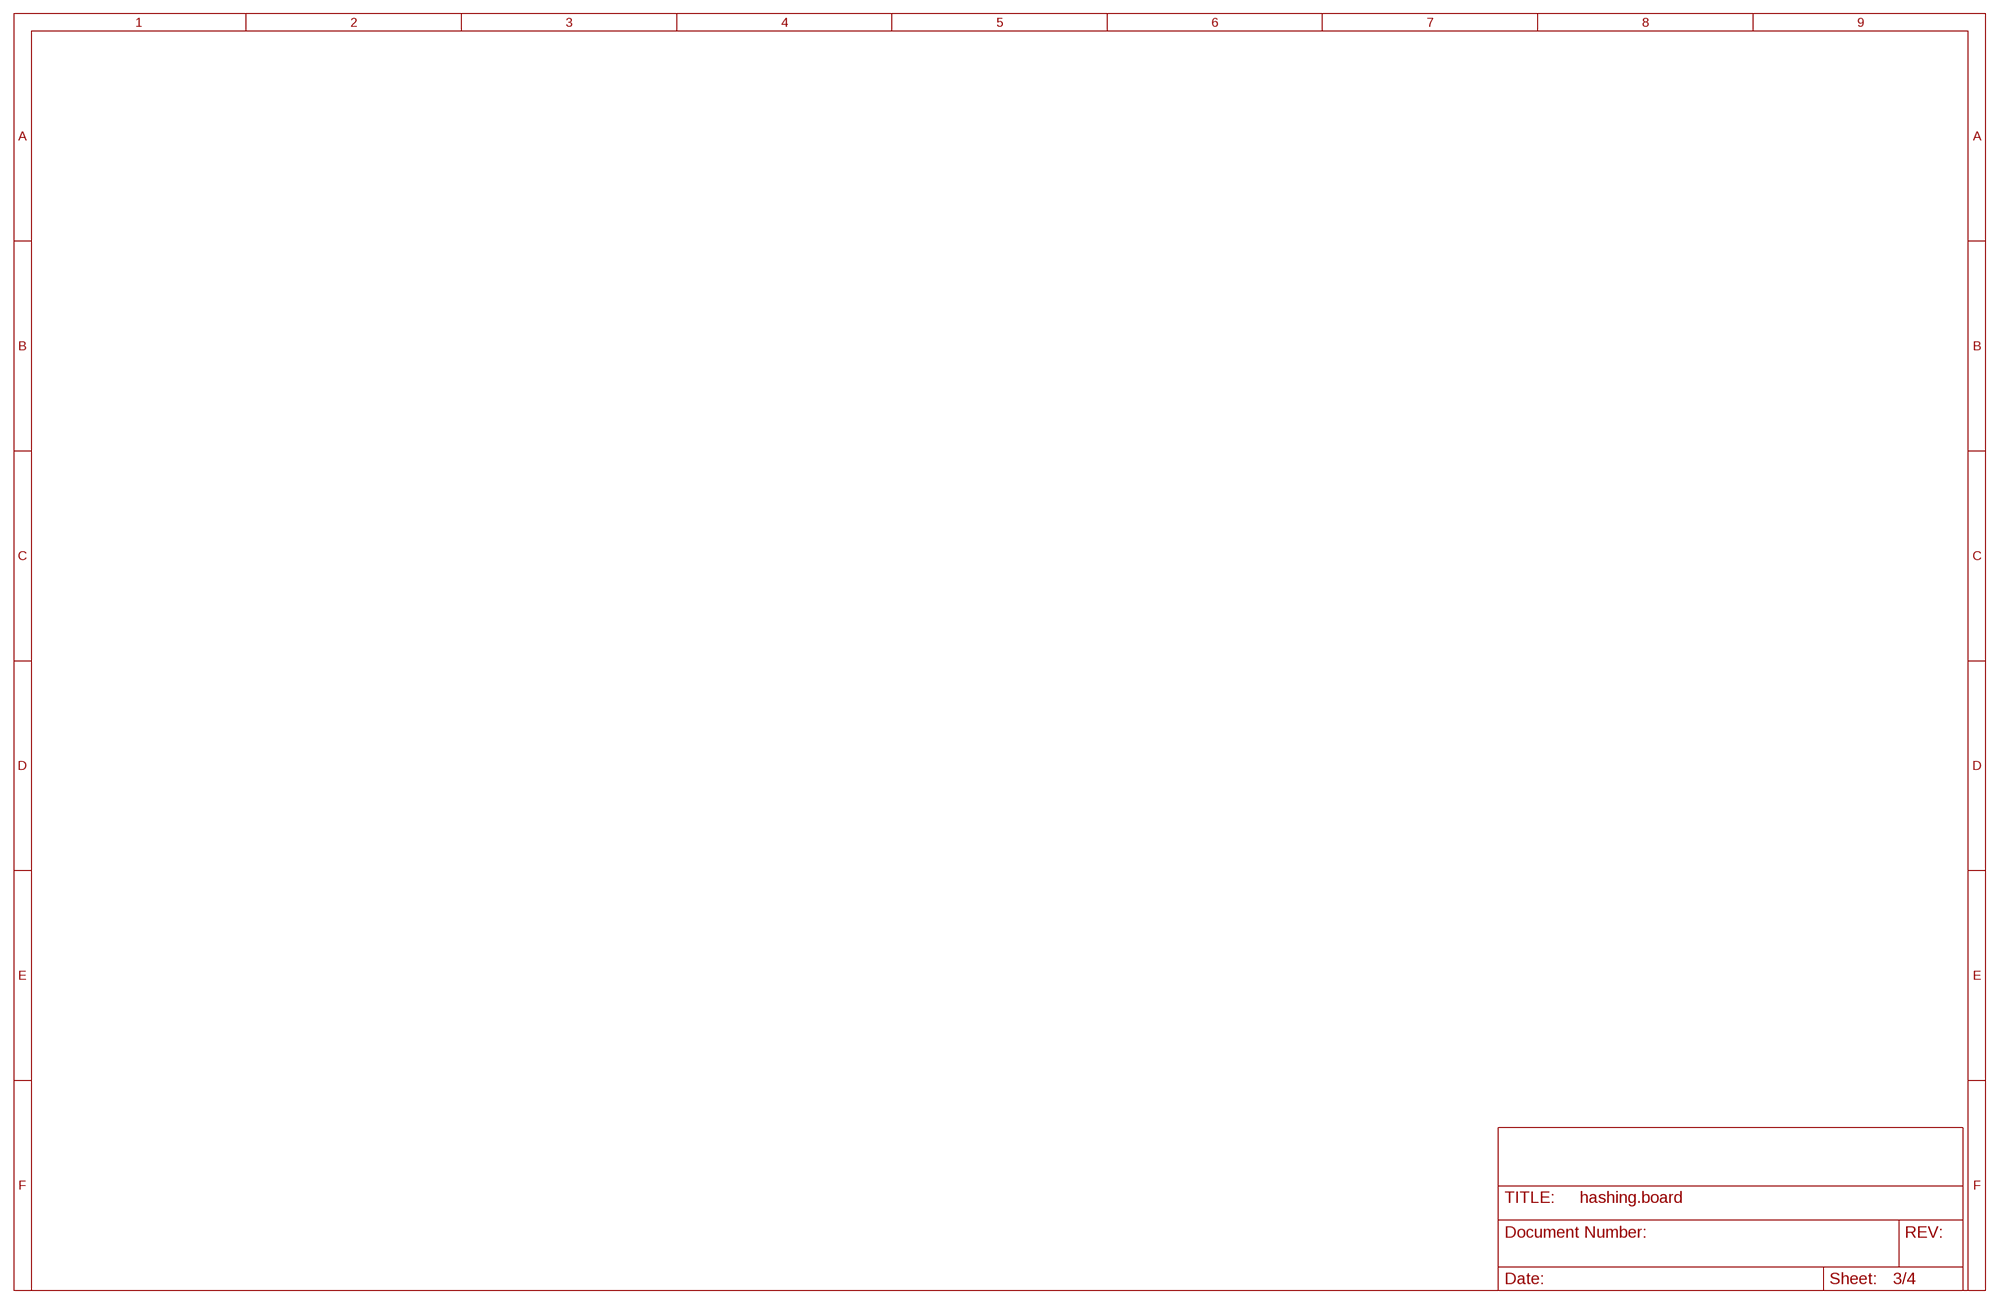
[diagram p2: schematic, sheet 3]

## Sheet 4 of 4
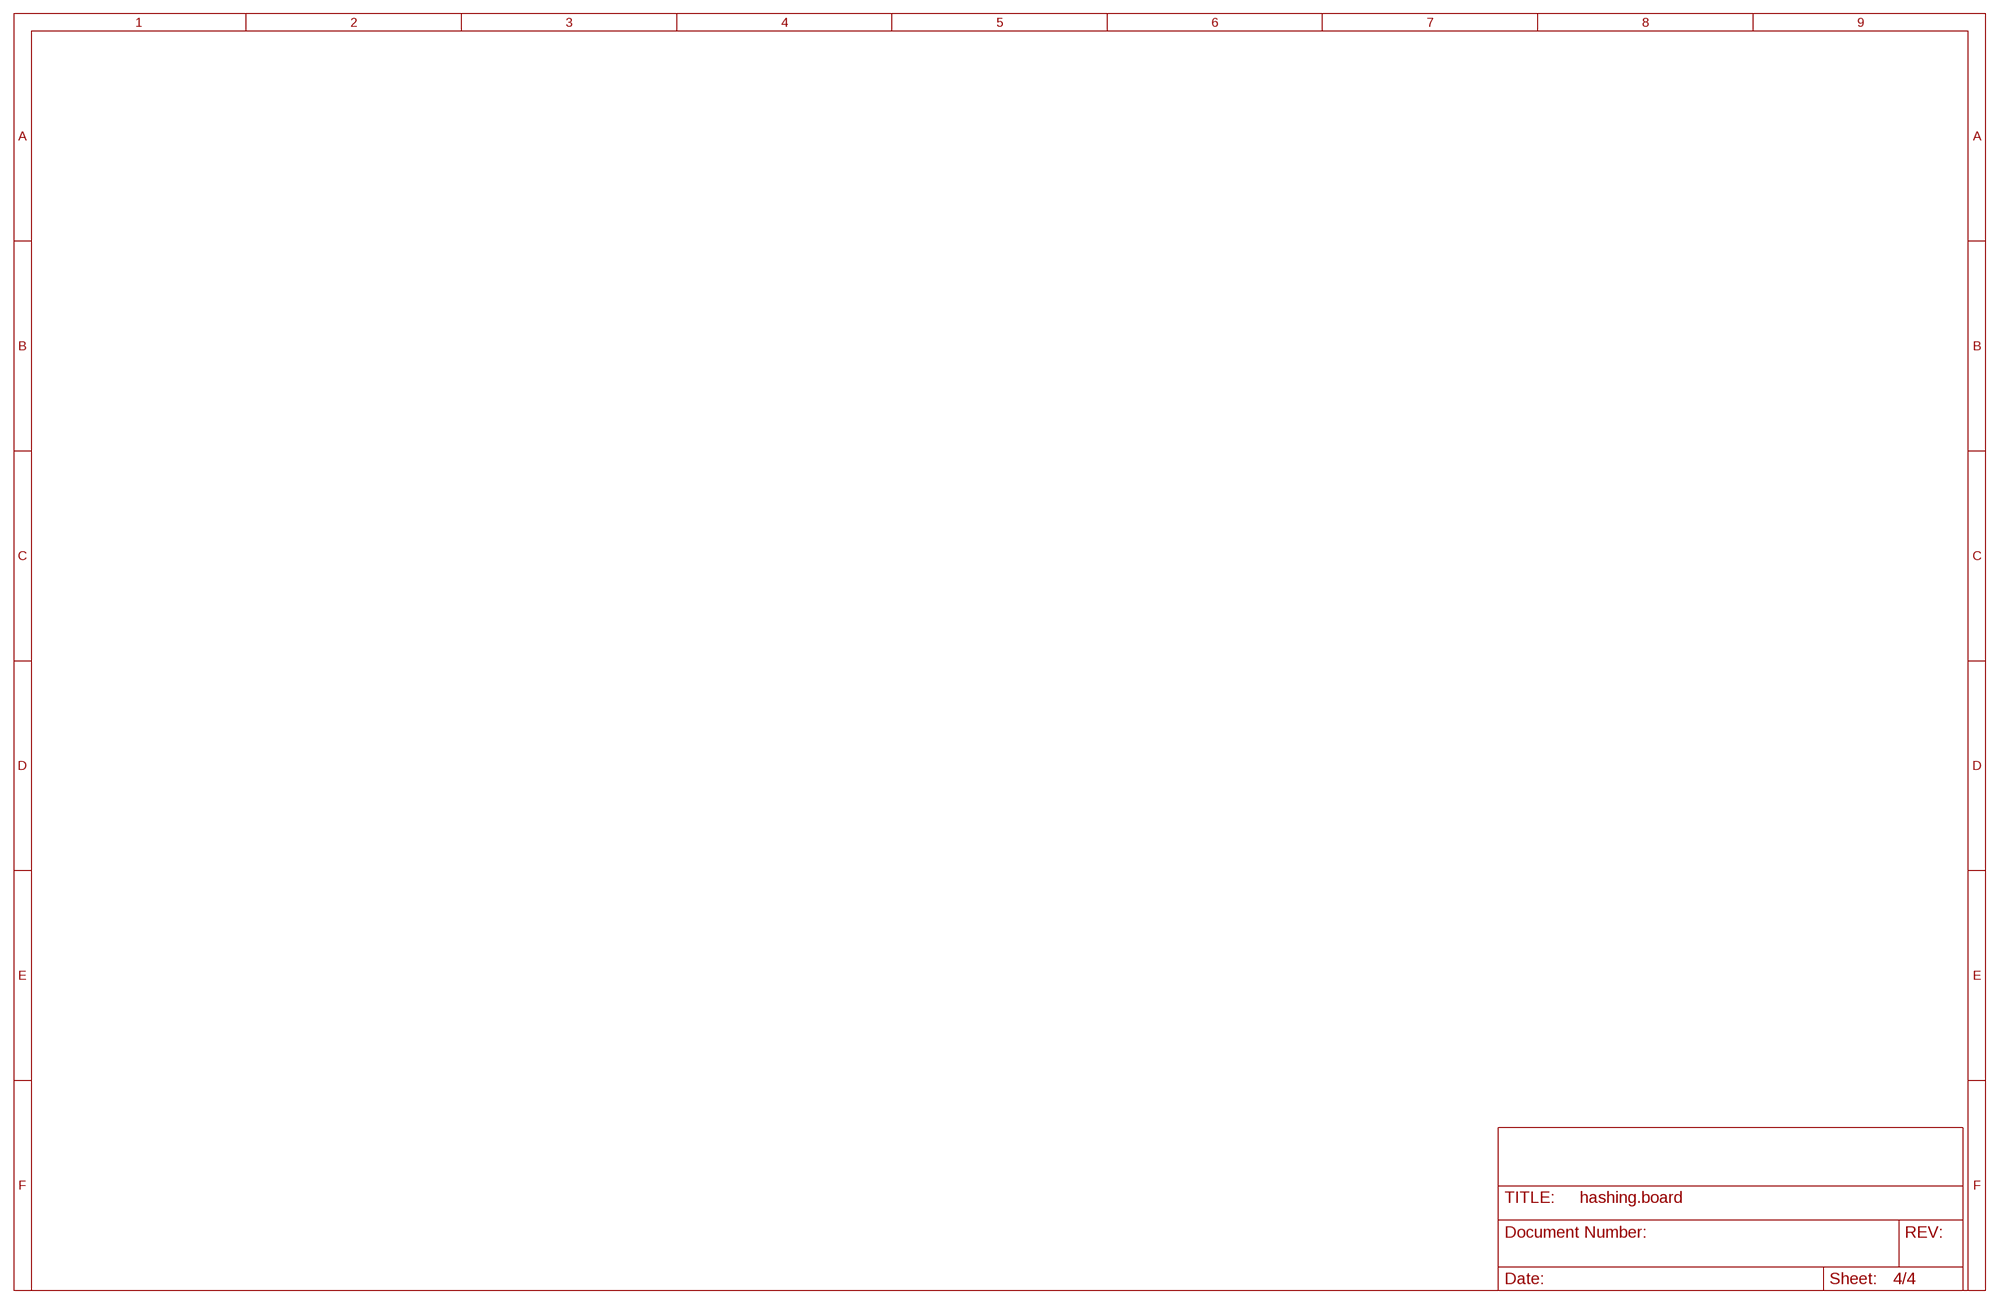
[diagram p3: schematic, sheet 4]

## Library data of the parts
C1 C101-C117 C201-C210 C301 C302 C501 C502 = rcl:C-EU: CAPACITOR, European symbol
CA1-CA8 = casey's_custom_stuff:BFL-BGA-144-SPC
PS1 PS2 = custom.power:YV09T60
R1-R13 R16 R17 = rcl:R-US_: RESISTOR, American symbol
R14 R15 = resistor:R-TRIMM: Trimm resistor
R18 R19 = resistor:R-US_: RESISTOR, American symbol
SV1 SV2 = con-lstb:MA05-2: PIN HEADER; OC_FARNELL: unknown; OC_NEWARK: unknown
U1-U8 = BFL.new.test:BFL-ASIC-1: BFL ASIC BGA-144 FIRST GENERATION
U9 = Atmel_By_element14_Batch_1:AT32UC3A1256-AUT: 32-Bit Microcontroller; DESCRIPTION: 32-Bit Microcontroller; MPN: AT32UC3A1256-AUT; OC_FARNELL: 1841637; OC_NEWARK: 91R0756; PACKAGE: TQFP-100; SUPPLIER: Atmel Corporation
U10 = Altera_By_element14_Batch_1:EPM570GT100C5N: CPLD, MAX II; MPN: EPM570GT100C5N; OC_FARNELL: 1549469; OC_NEWARK: 51R9462; PACKAGE: TQFP-100; SUPPLIER: Altera
X1 X2 = con-molex:5566-8: Mini FIT connector 8 pol Source: http://www.molex.com; OC_FARNELL: unknown; OC_NEWARK: unknown
X3 = con-cypressindustries:MINI-USB-: MINI USB-B Conector Source: www.cypressindustries.com; OC_FARNELL: unknown; OC_NEWARK: unknown
X4 = con-molex:22-23-2031: .100" (2.54mm) Center Header - 3 Pin; MF: MOLEX; MPN: 22-23-2031; OC_FARNELL: 1462950; OC_NEWARK: 30C0862

## Board
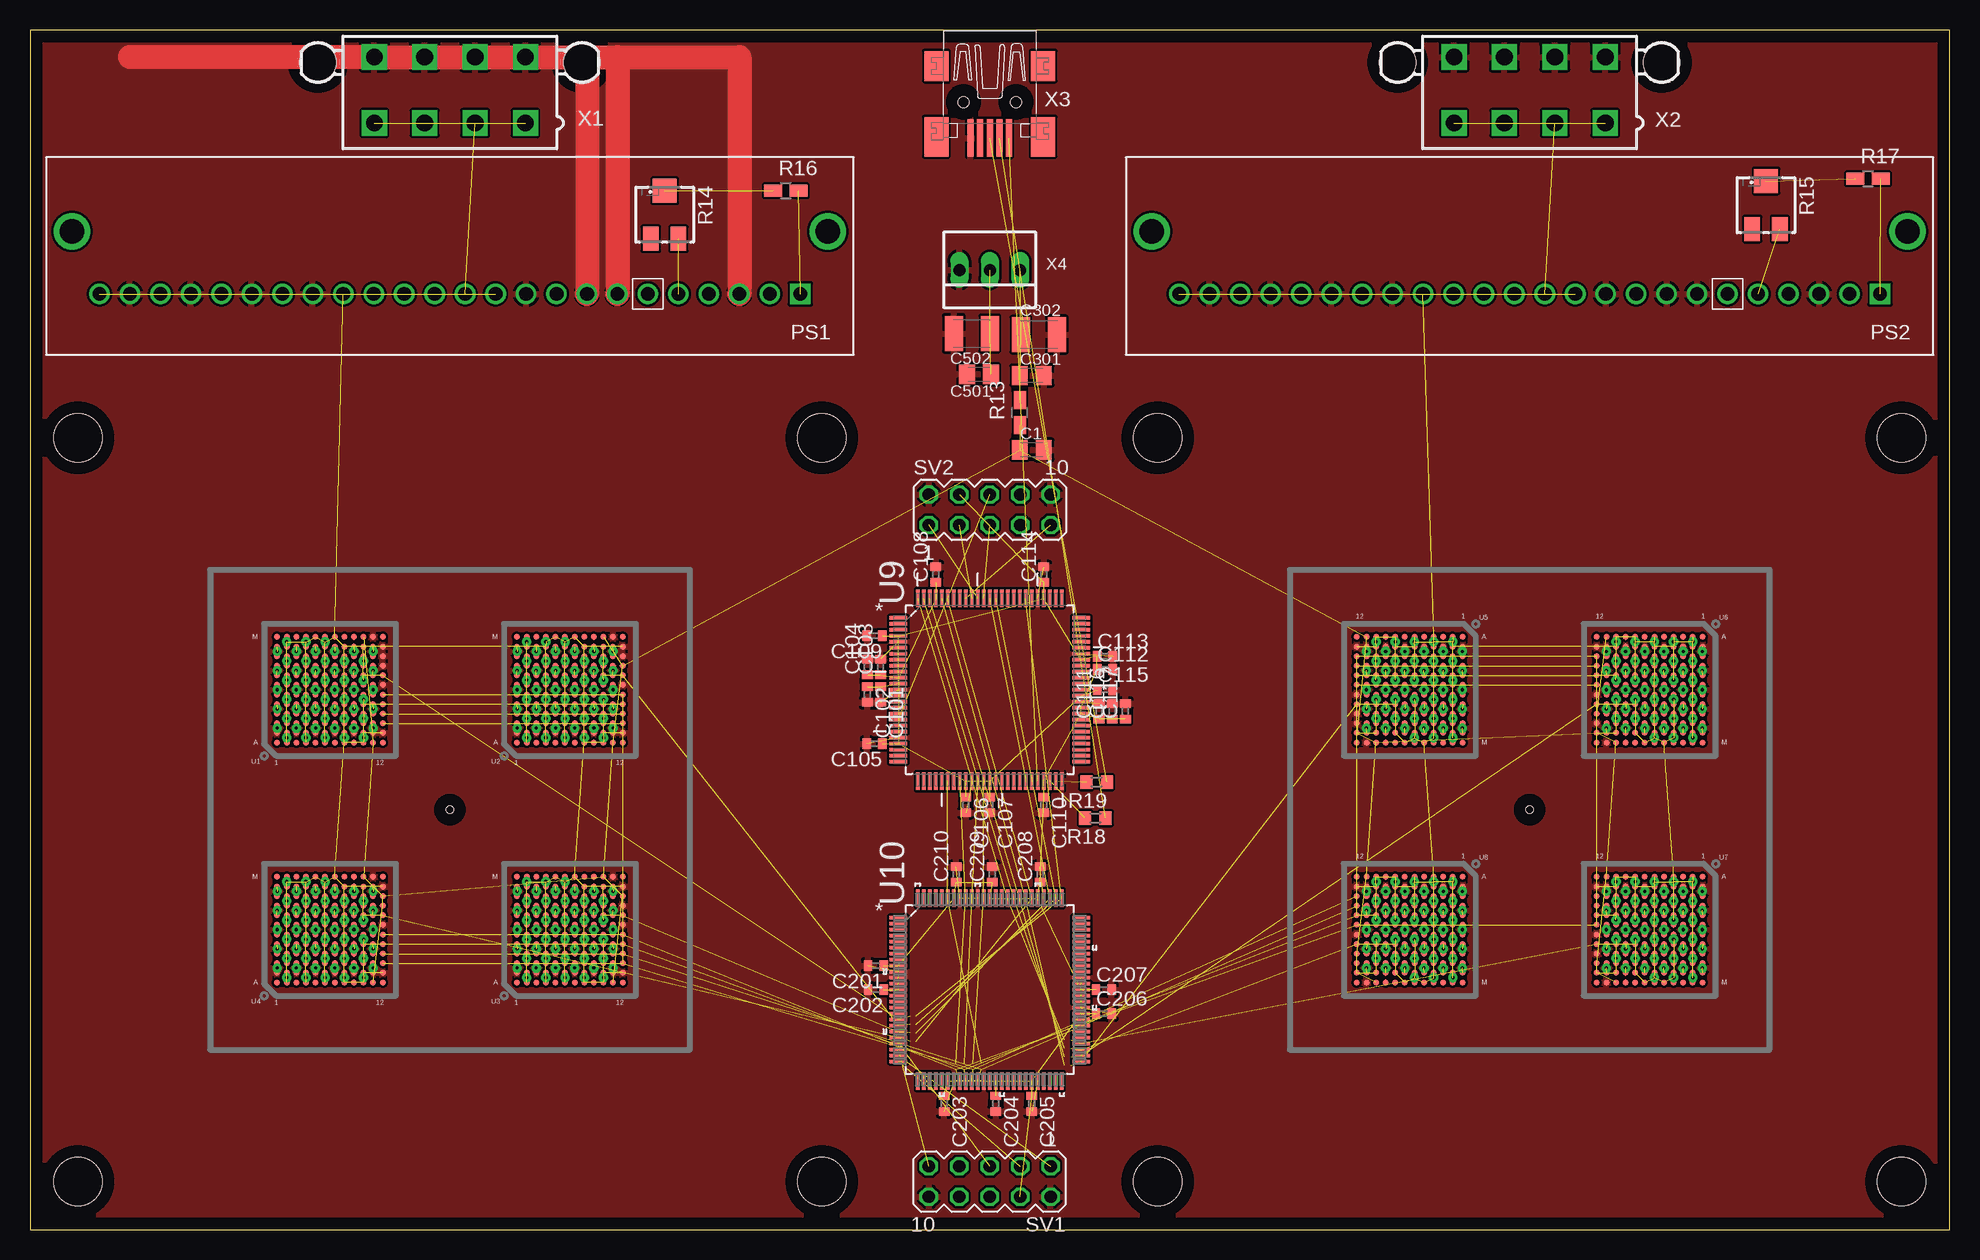
[diagram p4: board, top side]
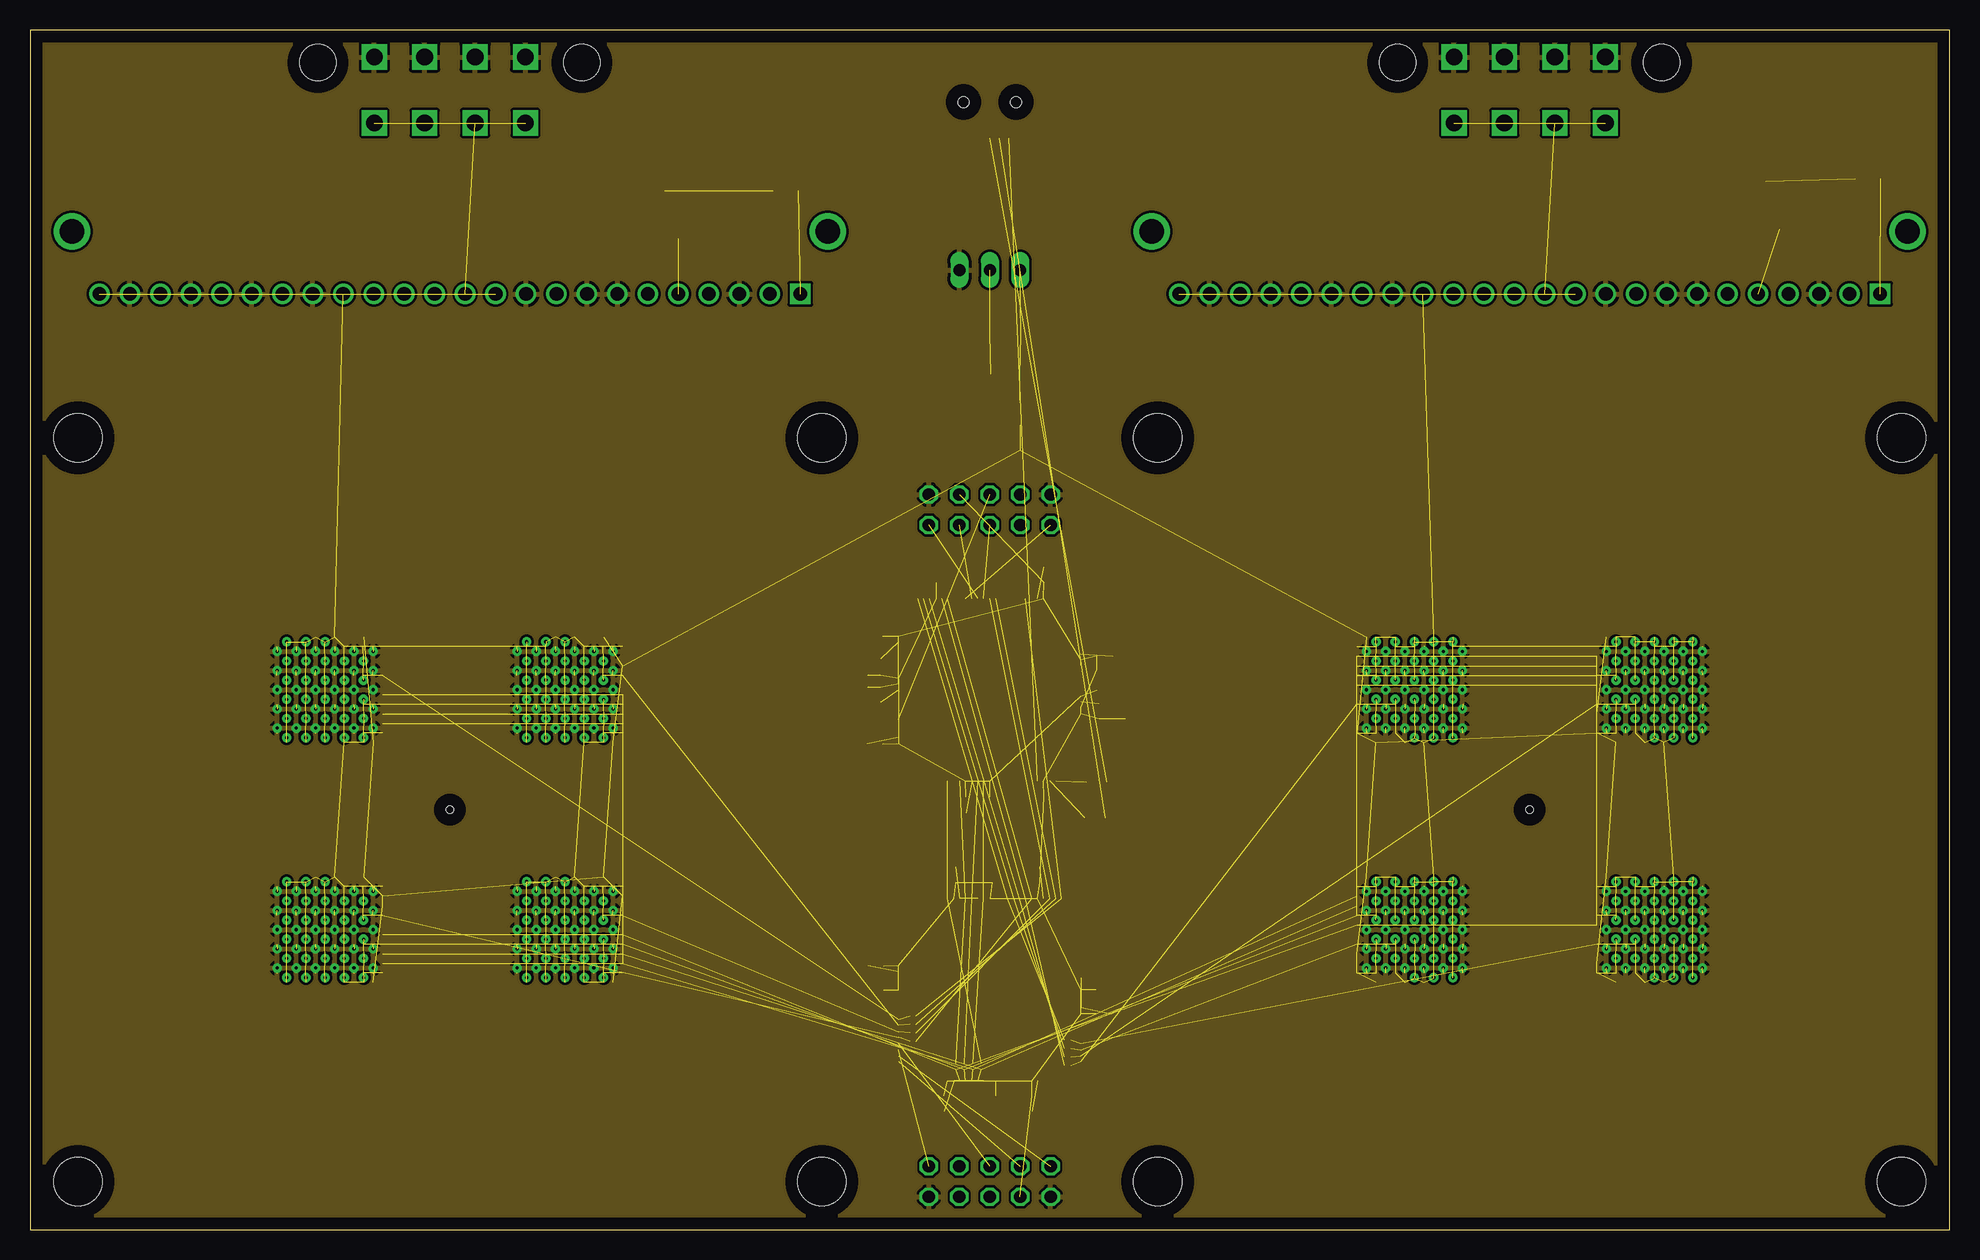
[diagram p5: board, inner layer $GND]
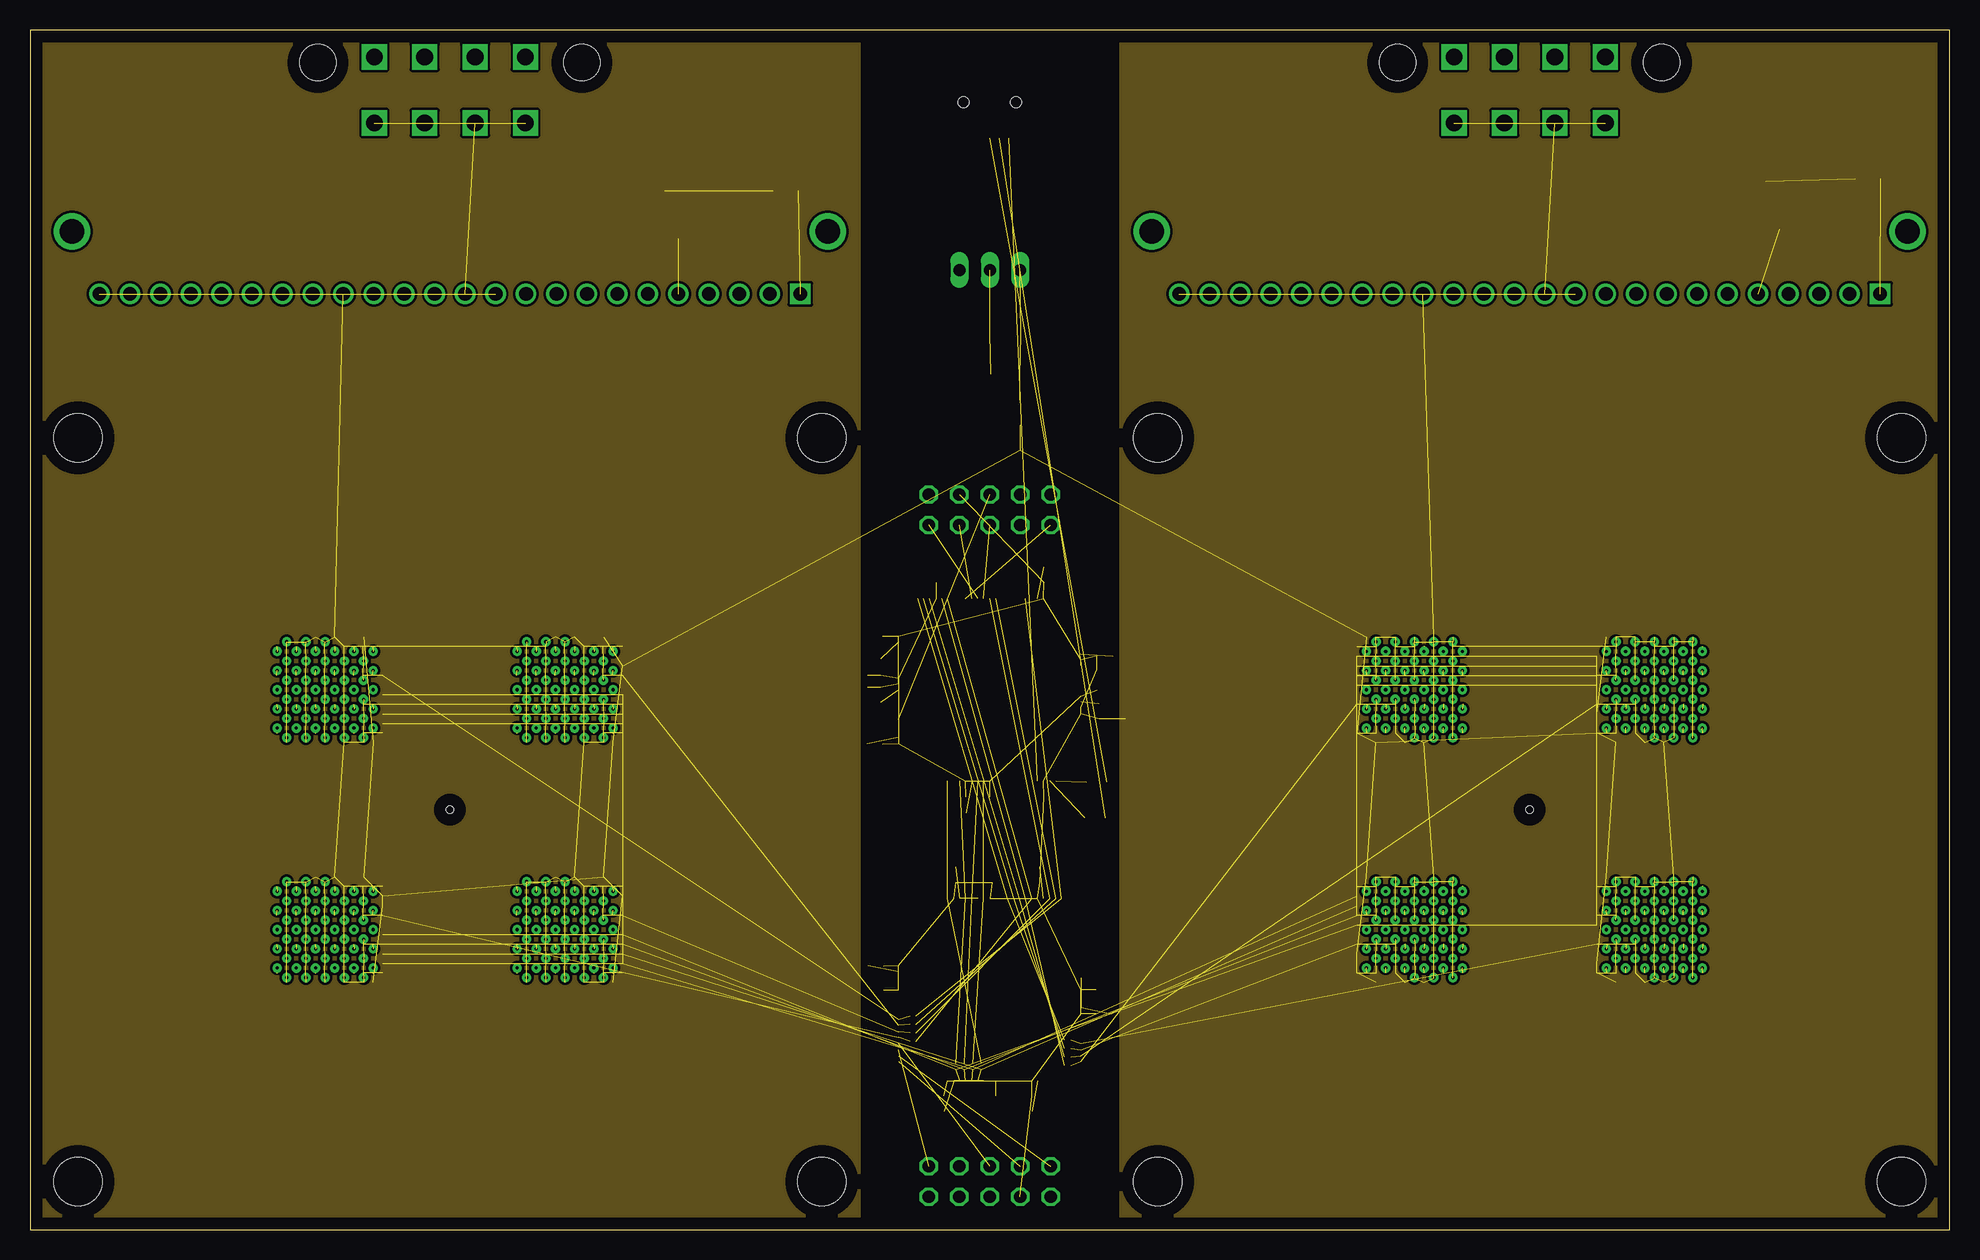
[diagram p6: board, inner layer $VCC]
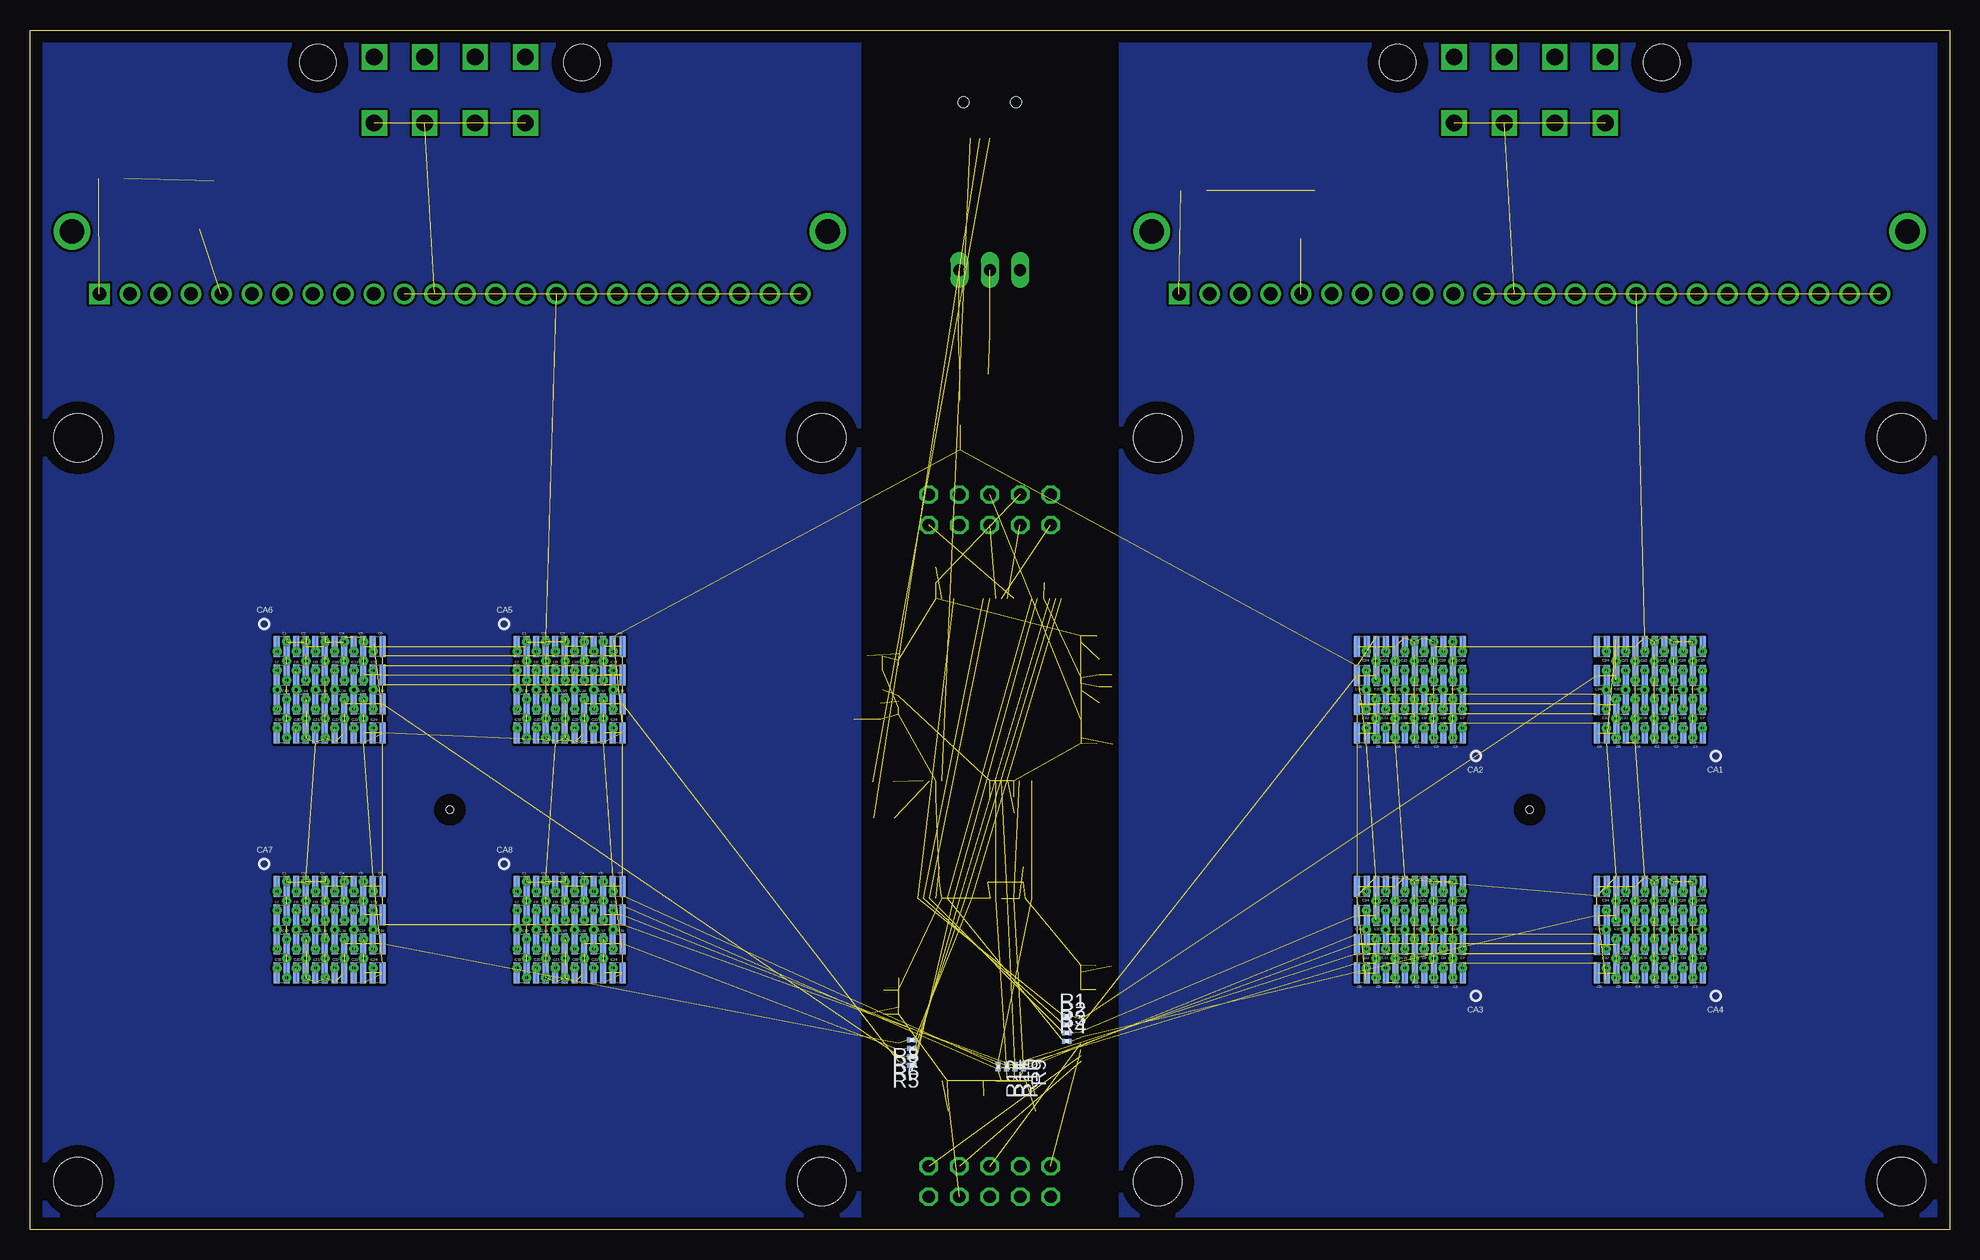
[diagram p7: board, bottom side, seen from below]

Size 160 x 100 mm. Coordinates in mm from the lower left corner, seen from the top.
Outline: 0,0 160,0 160,100 0,100 0,0
Copper layers (1*2*15*16): Top 0.075mm / dielectric 0.32mm / $GND 0.035mm / dielectric 0.32mm / $VCC 0.035mm / dielectric 0.32mm / Bottom 0.075mm
Design rules "default *": minimum track width 10mil, minimum drill 24mil, track to track 8mil, track to pad 8mil, pad to pad 8mil, via to via 8mil, smd to smd 8mil, copper to edge 40mil, drill to drill 8mil, minimum pad ring 10mil, minimum via ring 8mil, stop-mask expansion 4mil, vias tented up to drill 0mil, thermal gap 10mil
Holes 0.6 mm at 35,35 125,35
Holes 4 mm at 66,66 4,4 66,4 4,66 156,4 156,66 94,66 94,4

### Footprints (pad centres in the part's own frame; a part is rotated, then mirrored left to right if it is on the bottom)
C0805K = smd 1.3 x 1.6: 1 -1,0; 2 1,0
C0402 = smd 0.7 x 0.9: 1 -0.65,0; 2 0.65,0
C1210K = smd 1.5 x 2.9: 1 -1.5,0; 2 1.5,0
BFL-BGA-VIA-PATTERN = drill 0.26 pad 0.6: N$2 0.4,-1.6; N$3 0.4,0; N$5 2,-1.6; N$6 2,0; N$8 -1.2,0; N$9 -1.2,-1.6; N$11 -2.8,0; N$12 -2.8,-1.6; N$14 -4.4,-1.6; N$15 -4.4,0; N$16 3.6,-1.6; N$17 3.6,0; N$19 0.4,-3.2; N$21 2,-3.2; N$23 -1.2,-3.2; N$25 -2.8,-3.2; N$27 -4.4,-3.2; N$28 3.6,-3.2; N$30 -1.2,3.2; N$31 -1.2,1.6; N$33 -2.8,3.2; N$34 -2.8,1.6; N$36 0.4,1.6; N$37 0.4,3.2; N$39 2,1.6; N$40 2,3.2; N$42 3.6,3.2; N$43 3.6,1.6; N$44 -4.4,3.2; N$45 -4.4,1.6; P$1 -0.4,-0.8; P$4 1.2,-0.8; P$7 2.8,-0.8; P$10 -2,-0.8; P$13 -3.6,-0.8; P$18 -0.4,-2.4; P$20 1.2,-2.4; P$22 2.8,-2.4; P$24 -2,-2.4; P$26 -3.6,-2.4; P$29 -0.4,2.4; P$32 -2,2.4; P$35 -3.6,2.4; P$38 1.2,2.4; P$41 2.8,2.4; P$46 -0.4,4; P$47 -0.4,-4; P$48 -2,4; P$50 -3.6,4; P$51 -2,-4; P$52 1.2,4; P$53 -3.6,-4; P$54 2.8,4; P$57 -0.4,0.8; P$58 1.2,0.8; P$59 2.8,0.8; P$60 -2,0.8; P$61 -3.6,0.8 | smd 0.5 x 1.75: N$55 -4.42,1.21; N$62 -4.42,-1.19; N$64 -4.42,-3.59; N$66 -2.82,3.61; N$68 -2.82,1.21; N$70 -2.82,-1.19; N$72 -2.82,-3.59; N$74 -1.22,3.61; N$76 -1.22,1.21; N$78 -1.22,-1.19; N$80 -1.22,-3.59; N$82 0.38,3.61; N$84 0.38,1.21; N$86 0.38,-1.19; N$88 0.38,-3.59; N$90 1.98,3.61; N$92 1.98,1.21; N$94 1.98,-1.19; N$98 3.58,3.61; N$100 3.58,1.21; N$102 3.58,-1.19; N$104 1.98,-3.59; N$106 3.58,-3.59; N$110 -4.42,3.61; P$56 -3.62,1.21; P$63 -3.62,-1.19; P$65 -3.62,-3.59; P$67 -2.02,3.61; P$69 -2.02,1.21; P$71 -2.02,-1.19; P$73 -2.02,-3.59; P$75 -0.42,3.61; P$77 -0.42,1.21; P$79 -0.42,-1.19; P$81 -0.42,-3.59; P$83 1.18,3.61; P$85 1.18,1.21; P$87 1.18,-1.19; P$89 1.18,-3.59; P$91 2.78,3.61; P$93 2.78,1.21; P$95 2.78,-1.19; P$99 4.38,3.61; P$101 4.38,1.21; P$103 4.38,-1.19; P$105 2.78,-3.59; P$107 4.38,-3.59; P$111 -3.62,3.61
YV09T60 = drill 1.143 square: P$1 -29.21,0 | drill 1.143: P$2 -26.67,0; P$3 -24.13,0; P$4 -21.59,0; P$5 -19.05,0; P$6 -16.51,0; P$7 -13.97,0; P$8 -11.43,0; P$9 -8.89,0; P$10 -6.35,0; P$11 -3.81,0; P$12 -1.27,0; P$13 1.27,0; P$14 3.81,0; P$15 6.35,0; P$16 8.89,0; P$17 11.43,0; P$18 13.97,0; P$19 16.51,0; P$20 19.05,0; P$21 21.59,0; P$22 24.13,0; P$23 26.67,0; P$24 29.21,0 | drill 2.032: P$25 -31.496,-5.207; P$26 31.496,-5.207
R0201 = smd 0.28 x 0.43: 1 -0.255,0; 2 0.255,0
R0805W = smd 1.5 x 1: 1 -1.052,0; 2 1.052,0
RTRIM3224J = smd 1.3 x 2: 1 -1.15,-2; 3 1.15,-2 | smd 2 x 2: 2 0,2
R0603 = smd 1 x 1.1: 1 -0.85,0; 2 0.85,0
MA05-2 = drill 1.016 octagon: 1 -5.08,-1.27; 2 -5.08,1.27; 3 -2.54,-1.27; 4 -2.54,1.27; 5 0,-1.27; 6 0,1.27; 7 2.54,-1.27; 8 2.54,1.27; 9 5.08,-1.27; 10 5.08,1.27
BFL-BGA-BIG-PADS = smd 0.5 x 0.5: A1 4.4,4.4; A2 3.6,4.4; A3 2.8,4.4; A4 2,4.4; A5 1.2,4.4; A6 0.4,4.4; A7 -0.4,4.4; A8 -1.2,4.4; A9 -2,4.4; A10 -2.8,4.4; A11 -3.6,4.4; A12 -4.4,4.4; B1 4.4,3.6; B2 3.6,3.6; B3 2.8,3.6; B4 2,3.6; B5 1.2,3.6; B6 0.4,3.6; B7 -0.4,3.6; B8 -1.2,3.6; B9 -2,3.6; B10 -2.8,3.6; B11 -3.6,3.6; B12 -4.4,3.6; C1 4.4,2.8; C2 3.6,2.8; C3 2.8,2.8; C4 2,2.8; C5 1.2,2.8; C6 0.4,2.8; C7 -0.4,2.8; C8 -1.2,2.8; C9 -2,2.8; C10 -2.8,2.8; C11 -3.6,2.8; C12 -4.4,2.8; D1 4.4,2; D2 3.6,2; D3 2.8,2; D4 2,2; D5 1.2,2; D6 0.4,2; D7 -0.4,2; D8 -1.2,2; D9 -2,2; D10 -2.8,2; D11 -3.6,2; D12 -4.4,2; E1 4.4,1.2; E2 3.6,1.2; E3 2.8,1.2; E4 2,1.2; E5 1.2,1.2; E6 0.4,1.2; E7 -0.4,1.2; E8 -1.2,1.2; E9 -2,1.2; E10 -2.8,1.2; E11 -3.6,1.2; E12 -4.4,1.2; F1 4.4,0.4; F2 3.6,0.4; F3 2.8,0.4; F4 2,0.4; F5 1.2,0.4; F6 0.4,0.4; F7 -0.4,0.4; F8 -1.2,0.4; F9 -2,0.4; F10 -2.8,0.4; F11 -3.6,0.4; F12 -4.4,0.4; G1 4.4,-0.4; G2 3.6,-0.4; G3 2.8,-0.4; G4 2,-0.4; G5 1.2,-0.4; G6 0.4,-0.4; G7 -0.4,-0.4; G8 -1.2,-0.4; G9 -2,-0.4; G10 -2.8,-0.4; G11 -3.6,-0.4; G12 -4.4,-0.4; H1 4.4,-1.2; H2 3.6,-1.2; H3 2.8,-1.2; H4 2,-1.2; H5 1.2,-1.2; H6 0.4,-1.2; H7 -0.4,-1.2; H8 -1.2,-1.2; H9 -2,-1.2; H10 -2.8,-1.2; H11 -3.6,-1.2; H12 -4.4,-1.2; J1 4.4,-2; J2 3.6,-2; J3 2.8,-2; J4 2,-2; J5 1.2,-2; J6 0.4,-2; J7 -0.4,-2; J8 -1.2,-2; J9 -2,-2; J10 -2.8,-2; J11 -3.6,-2; J12 -4.4,-2; K1 4.4,-2.8; K2 3.6,-2.8; K3 2.8,-2.8; K4 2,-2.8; K5 1.2,-2.8; K6 0.4,-2.8; K7 -0.4,-2.8; K8 -1.2,-2.8; K9 -2,-2.8; K10 -2.8,-2.8; K11 -3.6,-2.8; K12 -4.4,-2.8; L1 4.4,-3.6; L2 3.6,-3.6; L3 2.8,-3.6; L4 2,-3.6; L5 1.2,-3.6; L6 0.4,-3.6; L7 -0.4,-3.6; L8 -1.2,-3.6; L9 -2,-3.6; L10 -2.8,-3.6; L11 -3.6,-3.6; L12 -4.4,-3.6; M1 4.4,-4.4; M2 3.6,-4.4; M3 2.8,-4.4; M4 2,-4.4; M5 1.2,-4.4; M6 0.4,-4.4; M7 -0.4,-4.4; M8 -1.2,-4.4; M9 -2,-4.4; M10 -2.8,-4.4; M11 -3.6,-4.4; M12 -4.4,-4.4
QFP50P1600X1600X120-100N = smd 1.473 x 0.279: 1 -7.62,5.994; 2 -7.62,5.512; 3 -7.62,5.004; 4 -7.62,4.496; 5 -7.62,3.988; 6 -7.62,3.505; 7 -7.62,2.997; 8 -7.62,2.489; 9 -7.62,2.007; 10 -7.62,1.499; 11 -7.62,0.991; 12 -7.62,0.508; 13 -7.62,0; 14 -7.62,-0.508; 15 -7.62,-0.991; 16 -7.62,-1.499; 17 -7.62,-2.007; 18 -7.62,-2.489; 19 -7.62,-2.997; 20 -7.62,-3.505; 21 -7.62,-3.988; 22 -7.62,-4.496; 23 -7.62,-5.004; 24 -7.62,-5.512; 25 -7.62,-5.994; 51 7.62,-5.994; 52 7.62,-5.512; 53 7.62,-5.004; 54 7.62,-4.496; 55 7.62,-3.988; 56 7.62,-3.505; 57 7.62,-2.997; 58 7.62,-2.489; 59 7.62,-2.007; 60 7.62,-1.499; 61 7.62,-0.991; 62 7.62,-0.508; 63 7.62,0; 64 7.62,0.508; 65 7.62,0.991; 66 7.62,1.499; 67 7.62,2.007; 68 7.62,2.489; 69 7.62,2.997; 70 7.62,3.505; 71 7.62,3.988; 72 7.62,4.496; 73 7.62,5.004; 74 7.62,5.512; 75 7.62,5.994 | smd 0.279 x 1.473: 26 -5.994,-7.62; 27 -5.512,-7.62; 28 -5.004,-7.62; 29 -4.496,-7.62; 30 -3.988,-7.62; 31 -3.505,-7.62; 32 -2.997,-7.62; 33 -2.489,-7.62; 34 -2.007,-7.62; 35 -1.499,-7.62; 36 -0.991,-7.62; 37 -0.508,-7.62; 38 0,-7.62; 39 0.508,-7.62; 40 0.991,-7.62; 41 1.499,-7.62; 42 2.007,-7.62; 43 2.489,-7.62; 44 2.997,-7.62; 45 3.505,-7.62; 46 3.988,-7.62; 47 4.496,-7.62; 48 5.004,-7.62; 49 5.512,-7.62; 50 5.994,-7.62; 76 5.994,7.62; 77 5.512,7.62; 78 5.004,7.62; 79 4.496,7.62; 80 3.988,7.62; 81 3.505,7.62; 82 2.997,7.62; 83 2.489,7.62; 84 2.007,7.62; 85 1.499,7.62; 86 0.991,7.62; 87 0.508,7.62; 88 0,7.62; 89 -0.508,7.62; 90 -0.991,7.62; 91 -1.499,7.62; 92 -2.007,7.62; 93 -2.489,7.62; 94 -2.997,7.62; 95 -3.505,7.62; 96 -3.988,7.62; 97 -4.496,7.62; 98 -5.004,7.62; 99 -5.512,7.62; 100 -5.994,7.62
5566-8 = drill 1.4 square: 1 6.3,-2.75; 2 2.1,-2.75; 3 -2.1,-2.75; 4 -6.3,-2.75; 5 6.3,2.75; 6 2.1,2.75; 7 -2.1,2.75; 8 -6.3,2.75 | hole 3: 11,2.29; -11,2.29
32005-301 = smd 3.1 x 0.5: 1 3,1.6; 2 3,0.8; 3 3,0; 4 3,-0.8; 5 3,-1.6 | smd 2.5 x 2: M1 -3,-4.45; M2 -3,4.45 | smd 3.3 x 2: M3 2.9,4.45; M4 2.9,-4.45 | hole 0.9: 0,2.2; 0,-2.2
22-23-2031 = drill 1 long: 1 -2.54,0; 2 0,0; 3 2.54,0

### Placement (x,y rotation side)
C1  83.5,65 0 top
C101  70.9,44.6 270 top
C102  69.8,44.6 270 top
C103  70.9,46.9 90 top
C104  69.8,46.9 90 top
C105  70.4,40.5 180 top
C106  78,35.4 270 top
C107  80,35.4 270 top
C108  75.5,54.6 90 top
C109  70.4,49.5 180 top
C110  84.5,35.4 270 top
C111  89.1,43.2 90 top
C112  89.6,46.7 0 top
C113  89.6,47.8 0 top
C114  84.5,54.6 90 top
C115  89.6,45 0 top
C116  90.2,43.2 90 top
C117  91.3,43.2 90 top
C201  70.5,22 180 top
C202  70.5,20 180 top
C203  76.2,10.5 270 top
C204  80.5,10.5 270 top
C205  83.5,10.5 270 top
C206  89.5,18 0 top
C207  89.5,20 0 top
C208  84.2,29.6 90 top
C209  80.2,29.6 90 top
C210  77.2,29.6 90 top
C301  83.5,71.2 0 top
C302  84.1,74.6 0 top
C501  79.1,71.3 180 top
C502  78.5,74.7 180 top
CA1  25,45 180 bottom
CA2  45,45 180 bottom
CA3  45,25 180 bottom
CA4  25,25 180 bottom
CA5  115,45 0 bottom
CA6  135,45 0 bottom
CA7  135,25 0 bottom
CA8  115,25 0 bottom
PS1  35,78 180 top
PS2  125,78 180 top
R1  73.6,17.8 0 bottom
R2  73.6,17.1 0 bottom
R3  73.6,16.4 0 bottom
R4  73.6,15.7 0 bottom
R5  86.5,13.7 180 bottom
R6  86.5,14.4 180 bottom
R7  86.5,15.1 180 bottom
R8  86.5,15.8 180 bottom
R9  77.2,13.6 270 bottom
R10  77.9,13.6 270 bottom
R11  78.6,13.6 270 bottom
R12  79.3,13.6 270 bottom
R13  82.5,68.1 90 top
R14  52.9,84.6 0 top
R15  144.7,85.4 0 top
R16  63,86.6 0 top
R17  153.2,87.6 0 top
R18  88.8,34.3 180 top
R19  88.9,37.3 180 top
SV1  80,4 180 top
SV2  80,60 0 top
U1  25,45 180 top
U2  45,45 180 top
U3  45,25 180 top
U4  25,25 180 top
U5  115,45 0 top
U6  135,45 0 top
U7  135,25 0 top
U8  115,25 0 top
U9  80,45 0 top
U10  80,20 0 top
X1  35,95 0 top
X2  125,95 0 top
X3  80,94 270 top
X4  80,80 180 top

### Tracks (layer width: path | path; a pad name or v marks a point on that pad's centre or on a via)
ATMEL_RST  (1 unrouted)
ATMEL_TCK  (1 unrouted)
ATMEL_TDI  (1 unrouted)
ATMEL_TDO  (1 unrouted)
ATMEL_TMS  (1 unrouted)
CHECK_VOLTAGE  (1 unrouted)
CPLD_TCK  (1 unrouted)
CPLD_TDI  (1 unrouted)
CPLD_TDO  (1 unrouted)
CPLD_TMS  (1 unrouted)
DONE0  (2 unrouted)
DONE1  (2 unrouted)
DONE2  (2 unrouted)
DONE3  (2 unrouted)
DONE4  (2 unrouted)
DONE5  (2 unrouted)
DONE6  (2 unrouted)
DONE7  (2 unrouted)
DONE_0  (2 unrouted)
DONE_1  (2 unrouted)
DONE_2  (2 unrouted)
DONE_3  (2 unrouted)
DONE_4  (2 unrouted)
DONE_5  (2 unrouted)
DONE_6  (2 unrouted)
DONE_7  (2 unrouted)
GND  (208 unrouted)
  Top 2: X1.5 46.43,97.75 PS1.P$8 | X1.8 23.57,97.75 | X1.8 18.49,97.75 | X1.5 48.97,97.75 PS1.P$7 | X1.5 59.13,97.75 PS1.P$3 | X1.8 13.41,97.75 | X1.8 8.33,97.75 | X1.8 X1.7 X1.6 X1.5
  pour Top: 1,1 159,1 159,99 1,99
  pour $GND: 1,99 159,99 159,1 1,1
N$5  (1 unrouted)
N$6  (1 unrouted)
N$7  (1 unrouted)
N$8  (1 unrouted)
N$9  (1 unrouted)
N$10  (1 unrouted)
N$11  (1 unrouted)
N$12  (1 unrouted)
N$13  (1 unrouted)
N$14  (1 unrouted)
SPI_1_CLK  (9 unrouted)
SPI_1_CLK_  (2 unrouted)
SPI_1_CS  (9 unrouted)
SPI_1_CS_  (2 unrouted)
SPI_1_MISO  (9 unrouted)
SPI_1_MISO_  (2 unrouted)
SPI_1_MOSI  (9 unrouted)
SPI_1_MOSI_  (2 unrouted)
VCC+1V8  (12 unrouted)
VCC+3V3  (39 unrouted)
VDD-1A  (246 unrouted)
VDD-1B  (246 unrouted)
VDD-1VA
  pour $VCC: 1,99 69,99 69,1 1,1
  pour Bottom: 1,1 69,1 69,99 1,99
VDD-1VB
  pour $VCC: 91,99 159,99 159,1 91,1
  pour Bottom: 91,1 159,1 159,99 91,99
VDD-3V3  (29 unrouted)
VIN1  (6 unrouted)
VIN2  (6 unrouted)
VIN-3.3V  (3 unrouted)
VIN-5.0V  (2 unrouted)

### Text on the board
tDocu: A3 | A4 | A5 | A2 | A1